# EAGLE design Falange_Lite (EAGLE 7.6.0)
CNAME: OffGrid-Devices Falange; CREVISION: B; DESIGNER: Tiago Angelo
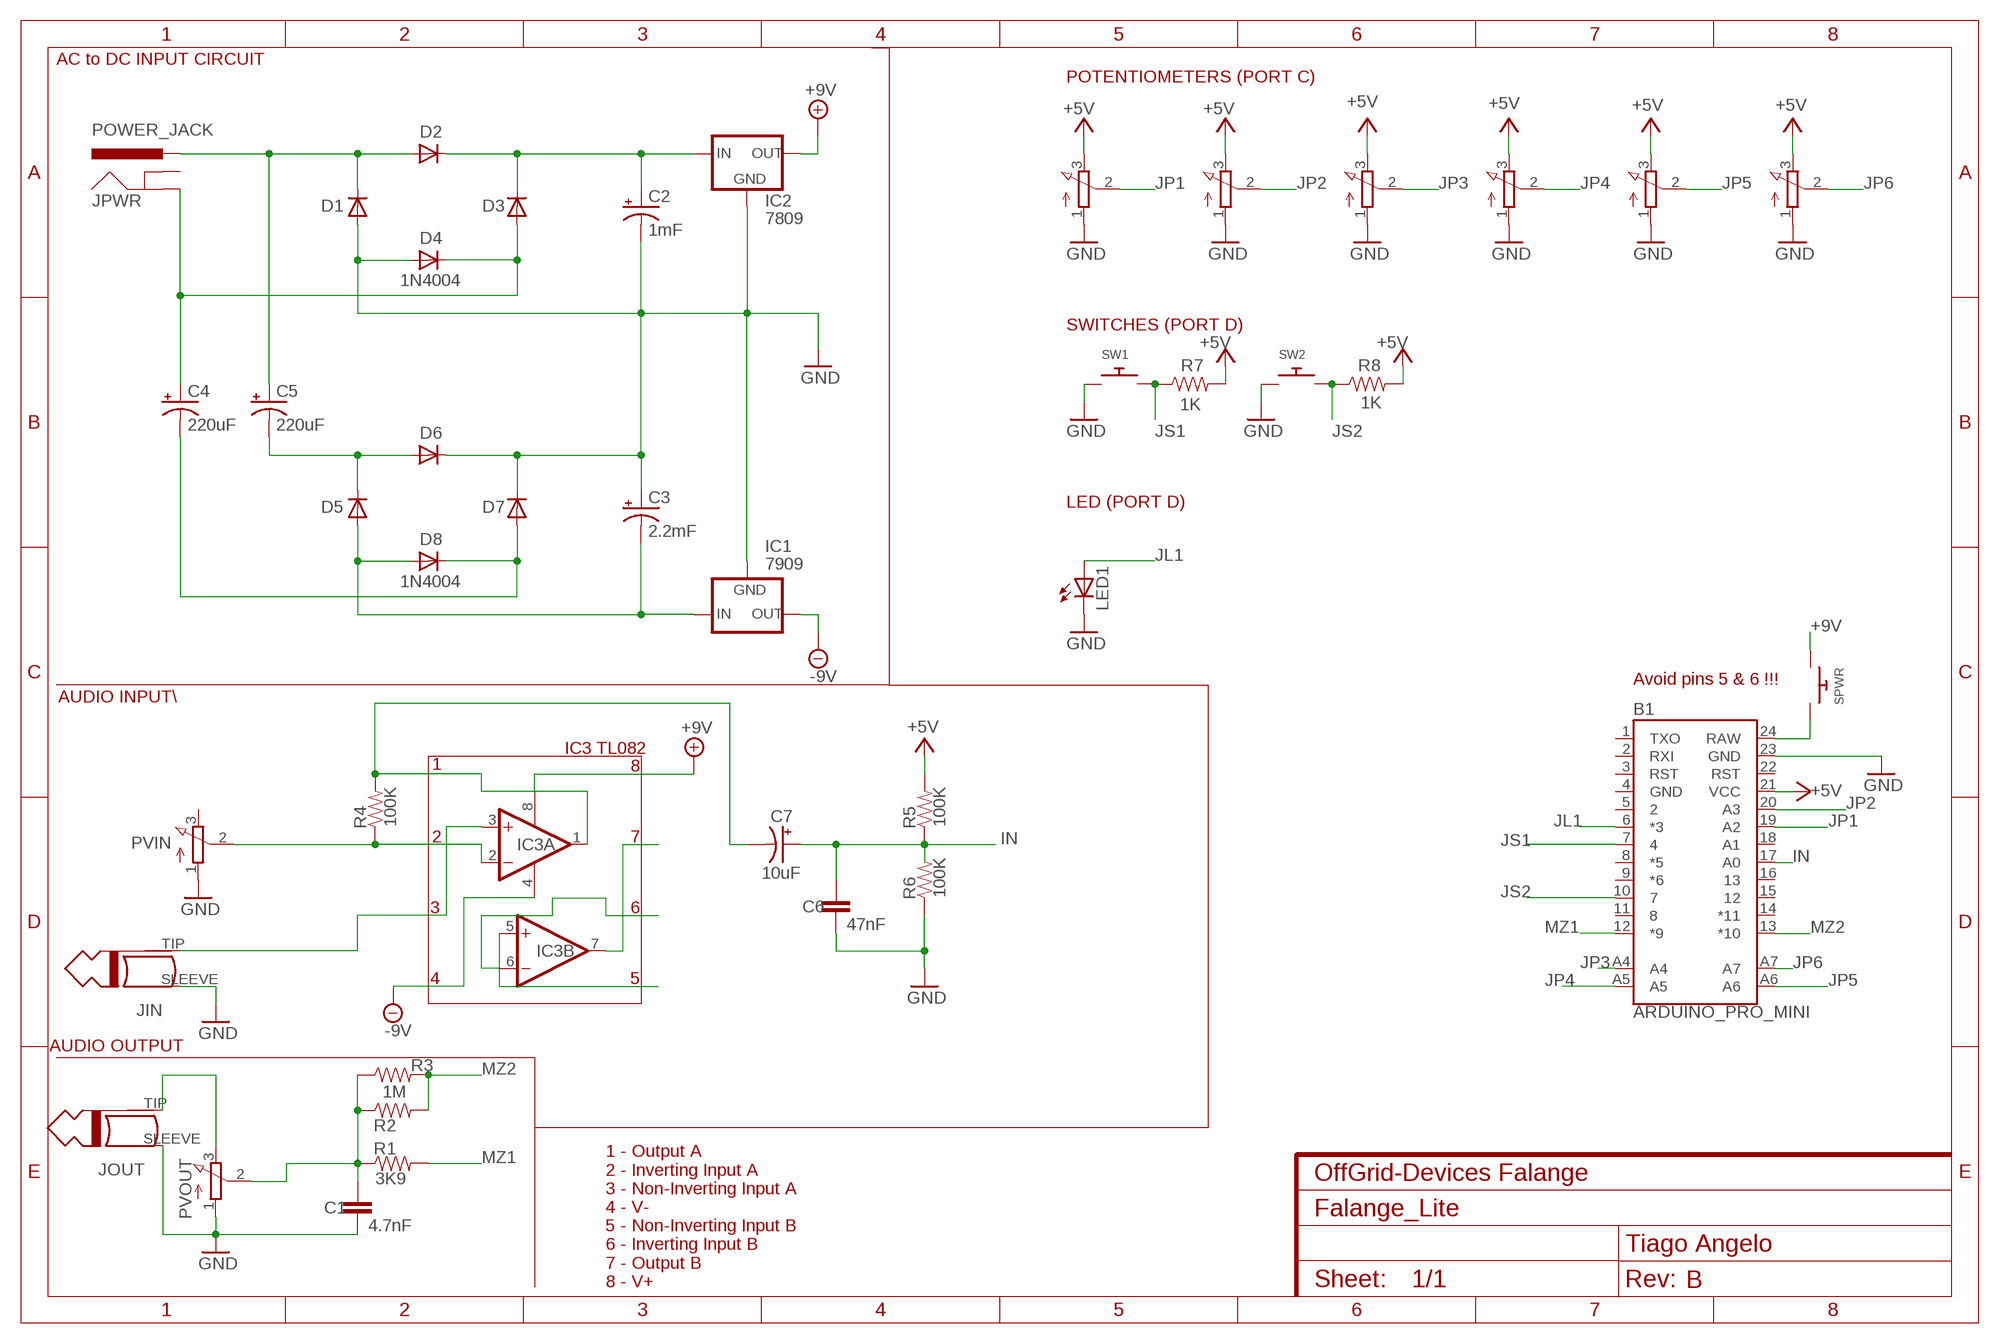
[diagram p0: schematic, sheet 1]

## Parts
B1  ARDUINO_PRO_MINI  [ARDUINO_PRO_MINI]
C1  4.7nF  C-EU050-025X075  [C050-025X075]
C2  1mF  CPOL-USE30-16AXIAL  [E30-16]
C3  2.2mF  CPOL-USE35-16AXIAL  [E35-16]
C4  220uF  CPOL-USE5-10.5  [E5-10,5]
C5  220uF  CPOL-USE5-10.5  [E5-10,5]
C6  47nF  C-EU050-025X075  [C050-025X075]
C7  10uF  CPOL-USE2.5-6  [E2,5-6]
D1  1N4004  [DO41-10]
D2  1N4004  [DO41-10]
D3  1N4004  [DO41-10]
D4  1N4004  [DO41-10]
D5  1N4004  [DO41-10]
D6  1N4004  [DO41-10]
D7  1N4004  [DO41-10]
D8  1N4004  [DO41-10]
IC1  7909  79XXL  [79XXL]
IC2  7809  78XXL  [78XXL]
IC3  TL082P  [DIL08]
JIN  MONO_PLUG  [TWO_PADS]
JOUT  MONO_PLUG  [TWO_PADS]
JPWR  POWER_JACK  [POWER_JACK_PTH]
LED1  LED3MM  [LED3MM]
P1  3RP/1610N  [3RP/1610N]
P2  3RP/1610N  [3RP/1610N]
P3  3RP/1610N  [3RP/1610N]
P4  3RP/1610N  [3RP/1610N]
P5  3RP/1610N  [3RP/1610N]
P6  3RP/1610N  [3RP/1610N]
PVIN  3RP/1610N  [3RP/1610N]
PVOUT  3RP/1610N  [3RP/1610N]
R1  3K9  1KOHM-HORIZ-1/4W-5%  [AXIAL-0.3]
R2  1M  1KOHM-HORIZ-1/4W-5%  [AXIAL-0.3]
R3  1M  1KOHM-HORIZ-1/4W-5%  [AXIAL-0.3]
R4  100K  1KOHM-HORIZ-1/4W-5%  [AXIAL-0.3]
R5  100K  1KOHM-HORIZ-1/4W-5%  [AXIAL-0.3]
R6  100K  1KOHM-HORIZ-1/4W-5%  [AXIAL-0.3]
R7  1K  1KOHM-HORIZ-1/4W-5%  [AXIAL-0.3]
R8  1K  1KOHM-HORIZ-1/4W-5%  [AXIAL-0.3]
SPWR  SWITCH_PUSHBUTTONEVQ-PE  [TACT_PANA-EVQ]
SW1  SWITCH_PUSHBUTTONEVQ-PE  [TACT_PANA-EVQ]
SW2  SWITCH_PUSHBUTTONEVQ-PE  [TACT_PANA-EVQ]

## Nets
+5V: B1.21(VCC) P1.3(E) P2.3(E) P3.3(E) P4.3(E) P5.3(E) P6.3(E) R5.P$2 R7.P$2 R8.P$2
+9V: IC2.OUT IC3.8(P:V+) SPWR.P$1
-9V: IC1.OUT IC3.4(P:V-)
GND: B1.23(GND) C1.2 C2.- C3.+ C6.2 D1.A D4.A D6.C D7.C IC1.GND IC2.GND JIN.SLEEVE JOUT.SLEEVE LED1.K(C) P1.1(A) P2.1(A) P3.1(A) P4.1(A) P5.1(A) P6.1(A) PVIN.1(A) PVOUT.1(A) R6.P$1 SW1.P$1 SW2.P$1
IN: B1.17(A0) C6.1 C7.+ R5.P$1 R6.P$2
JL1: B1.6(*3) LED1.A
JP1: B1.19(A2) P1.2(S)
JP2: B1.20(A3) P2.2(S)
JP3: B1.A4 P3.2(S)
JP4: B1.A5 P4.2(S)
JP5: B1.A6 P5.2(S)
JP6: B1.A7 P6.2(S)
JP8-2: C1.1 PVOUT.2(S) R1.P$1 R2.P$1 R3.P$1
JP8-3: JOUT.TIP PVOUT.3(E)
JS1: B1.7 R7.P$1 SW1.P$2
JS2: B1.10 R8.P$1 SW2.P$2
MZ1: B1.12(*9) R1.P$2
MZ2: B1.13(*10) R2.P$2 R3.P$2
N$1: C5.+ D1.C D2.A JPWR.PWR
N$2: C5.- D5.C D6.A
N$3: C4.+ D3.A D4.C JPWR.GND
N$4: C4.- D7.A D8.C
N$5: C2.+ D2.C D3.C IC2.IN
N$6: B1.24(RAW) SPWR.P$2
N$7: C3.- D5.A D8.A IC1.IN
N$8: C7.- IC3.1(A:OUT) R4.P$2
N$9: IC3.2(A:-IN) PVIN.2(S) R4.P$1
N$12: IC3.7(B:OUT)
N$13: IC3.6(B:-IN)
N$14: IC3.5(B:+IN)
N$15: IC3.3(A:+IN) JIN.TIP
Unconnected: B1.1(TXO) B1.2(RXI) B1.3(RST) B1.5 B1.8(*5) B1.9(*6) B1.11 B1.14(*11) B1.15 B1.16 B1.18(A1) B1.22(RST) JPWR.GNDBREAK PVIN.3(E)

## Notes on the sheet
- AC to DC INPUT CIRCUIT
- POTENTIOMETERS (PORT C)
- SWITCHES (PORT D)
- LED (PORT D)
- Avoid pins 5 & 6 !!!
- AUDIO INPUT\
- IC3 TL082
- 1 | 8
- 2 | 7
- 3 | 6
- 4 | 5
- AUDIO OUTPUT
- 1 - Output A
  2 - Inverting Input A
  3 - Non-Inverting Input A
  4 - V-
  5 - Non-Inverting Input B
  6 - Inverting Input B
  7 - Output B
  8 - V+

## Power pins joined to a net without a drawn wire
GND: B1.4(GND)

## Library data of the parts
B1 = SparkFun-Boards:ARDUINO_PRO_MINI: SparkFun Pro Mini Pro Mini compatible footprint. Dimensions: 0.7 x 1.3" PCB Thickness: 0.8mm SparkFun Products: 3.3V/8MHz <https://www.sparkfun.com/products/11114> 5V/16MHz <https://www.sparkfun.com/products/11113>
C1 C6 = rcl:C-EU: CAPACITOR, European symbol
C2 C3 = offgrid-devices:CPOL-US: POLARIZED CAPACITOR, American symbol
C4 C5 C7 = rcl:CPOL-US: POLARIZED CAPACITOR, American symbol
D1-D8 = adafruit:1N4004: DIODE General purpose 1N400x type rectifier (With bigger pads) http://www.ladyada.net/library/pcb/eaglelibrary.html
IC1 = v-reg:79XXL: VOLTAGE REGULATOR
IC2 = v-reg:78XXL: VOLTAGE REGULATOR
IC3 = linear:TL082: OP AMP Data sheet <http://www.ti.com/lit/ds/symlink/tl084a . pdf>; DATA_SHEET: <a href="http://www.ti.com/lit/ds/symlink/tl084a.pdf"> Data sheet </a>
JIN JOUT = gm-jacks:MONO_PLUG
JPWR = SparkFun-Connectors:POWER_JACK: Power Jack Connector This is the standard 5.5mm barrel jack for power. The PTH is the most common, proven, reliable, footprint. The Slot footprint only works if the mill layer is transmitted to the PCB fab house so be warned. Here are the connectors we sell at SparkFun: DC Barrel Power Jack/Connector <https://www.sparkfun.com/products/119> (PRT-00119) DC Barrel Power Jack/Connector (SMD) <https://www.sparkfun.com/products/12748> (PRT-12748) DC Barrel Jack Adapter - Breadboard Compatible <https://www.sparkfun.com/products/10811> (PRT-10811) It is used on this SparkFun product (and many, many others): SparkFun RedBoard - Programmed with Arduino <https://www.sparkfun.com/products/12757> (DEV-12757) Also, if you need a mating power supply or connector, please check these out: Wall Adapter Power Supply - 9VDC 650mA <https://www.sparkfun.com/products/298> (TOL-00298) DC Barrel Jack Adapter - Male <https://www.sparkfun.com/products/10287> (PRT-10287); PROD_ID: CONN-08197
LED1 = led:LED: LED OSRAM: - CHIPLED LG R971, LG N971, LY N971, LG Q971, LY Q971, LO R971, LY R971 LH N974, LH R974 LS Q976, LO Q976, LY Q976 LO Q996 - Hyper CHIPLED LW Q18S LB Q993, LB Q99A, LB R99A - SideLED LS A670, LO A670, LY A670, LG A670, LP A670 LB A673, LV A673, LT A673, LW A673 LH A674 LY A675 LS A676, LA A676, LO A676, LY A676, LW A676 LS A679, LY A679, LG A679 - Hyper Micro SIDELED® LS Y876, LA Y876, LO Y876, LY Y876 LT Y87S - SmartLED LW L88C, LW L88S LB L89C, LB L89S, LG L890 LS L89K, LO L89K, LY L89K LS L896, LA L896, LO L896, LY L896 - TOPLED LS T670, LO T670, LY T670, LG T670, LP T670 LSG T670, LSP T670, LSY T670, LOP T670, LYG T670 LG T671, LOG T671, LSG T671 LB T673, LV T673, LT T673, LW T673 LH T674 LS T676, LA T676, LO T676, LY T676, LB T676, LH T676, LSB T676, LW T676 LB T67C, LV T67C, LT T67C, LS T67K, LO T67K, LY T67K, LW E67C LS E67B, LA E67B, LO E67B, LY E67B, LB E67C, LV E67C, LT E67C LW T67C LS T679, LY T679, LG T679 LS T770, LO T770, LY T770, LG T770, LP T770 LB T773, LV T773, LT T773, LW T773 LH T774 LS E675, LA E675, LY E675, LS T675 LS T776, LA T776, LO T776, LY T776, LB T776 LHGB T686 LT T68C, LB T68C - Hyper Mini TOPLED® LB M676 - Mini TOPLED Santana® LG M470 LS M47K, LO M47K, LY M47K Source: http://www.osram.convergy.de LUXEON: - LUMILED® LXK2-PW12-R00, LXK2-PW12-S00, LXK2-PW14-U00, LXK2-PW14-V00 LXK2-PM12-R00, LXK2-PM12-S00, LXK2-PM14-U00 LXK2-PE12-Q00, LXK2-PE12-R00, LXK2-PE12-S00, LXK2-PE14-T00, LXK2-PE14-U00 LXK2-PB12-K00, LXK2-PB12-L00, LXK2-PB12-M00, LXK2-PB14-N00, LXK2-PB14-P00, LXK2-PB14-Q00 LXK2-PR12-L00, LXK2-PR12-M00, LXK2-PR14-Q00, LXK2-PR14-R00 LXK2-PD12-Q00, LXK2-PD12-R00, LXK2-PD12-S00 LXK2-PH12-R00, LXK2-PH12-S00 LXK2-PL12-P00, LXK2-PL12-Q00, LXK2-PL12-R00 Source: www.luxeon.com KINGBRIGHT: KA-3528ASYC Source: www.kingbright.com
P1-P6 PVIN PVOUT = pot:3RP/1610N: 16mm Potentiometer one level Source: http://www.alphapotentiometers.net/html/16mm_pot_2.html
R1-R8 = SparkFun-Resistors:1KOHM: 1kΩ resistor A resistor is a passive two-terminal electrical component that implements electrical resistance as a circuit element. Resistors act to reduce current flow, and, at the same time, act to lower voltage levels within circuits. - Wikipedia; PROD_ID: RES-08380; VALUE: 1k
SPWR SW1 SW2 = adafruit:SWITCH_PUSHBUTTON: Buttons SOFTTOUCHSMD_SJ - Soft touch temporary push button (Super Junk Akihabara) Compatible with SKPMANE010 [Mouser: 688-SKPMAN] C&K_KSS = Digikey: KSS221GLFS

## Net classes
0 default: width 0.508 mm, drill 0.508 mm, clearance 0.406 mm

## Board
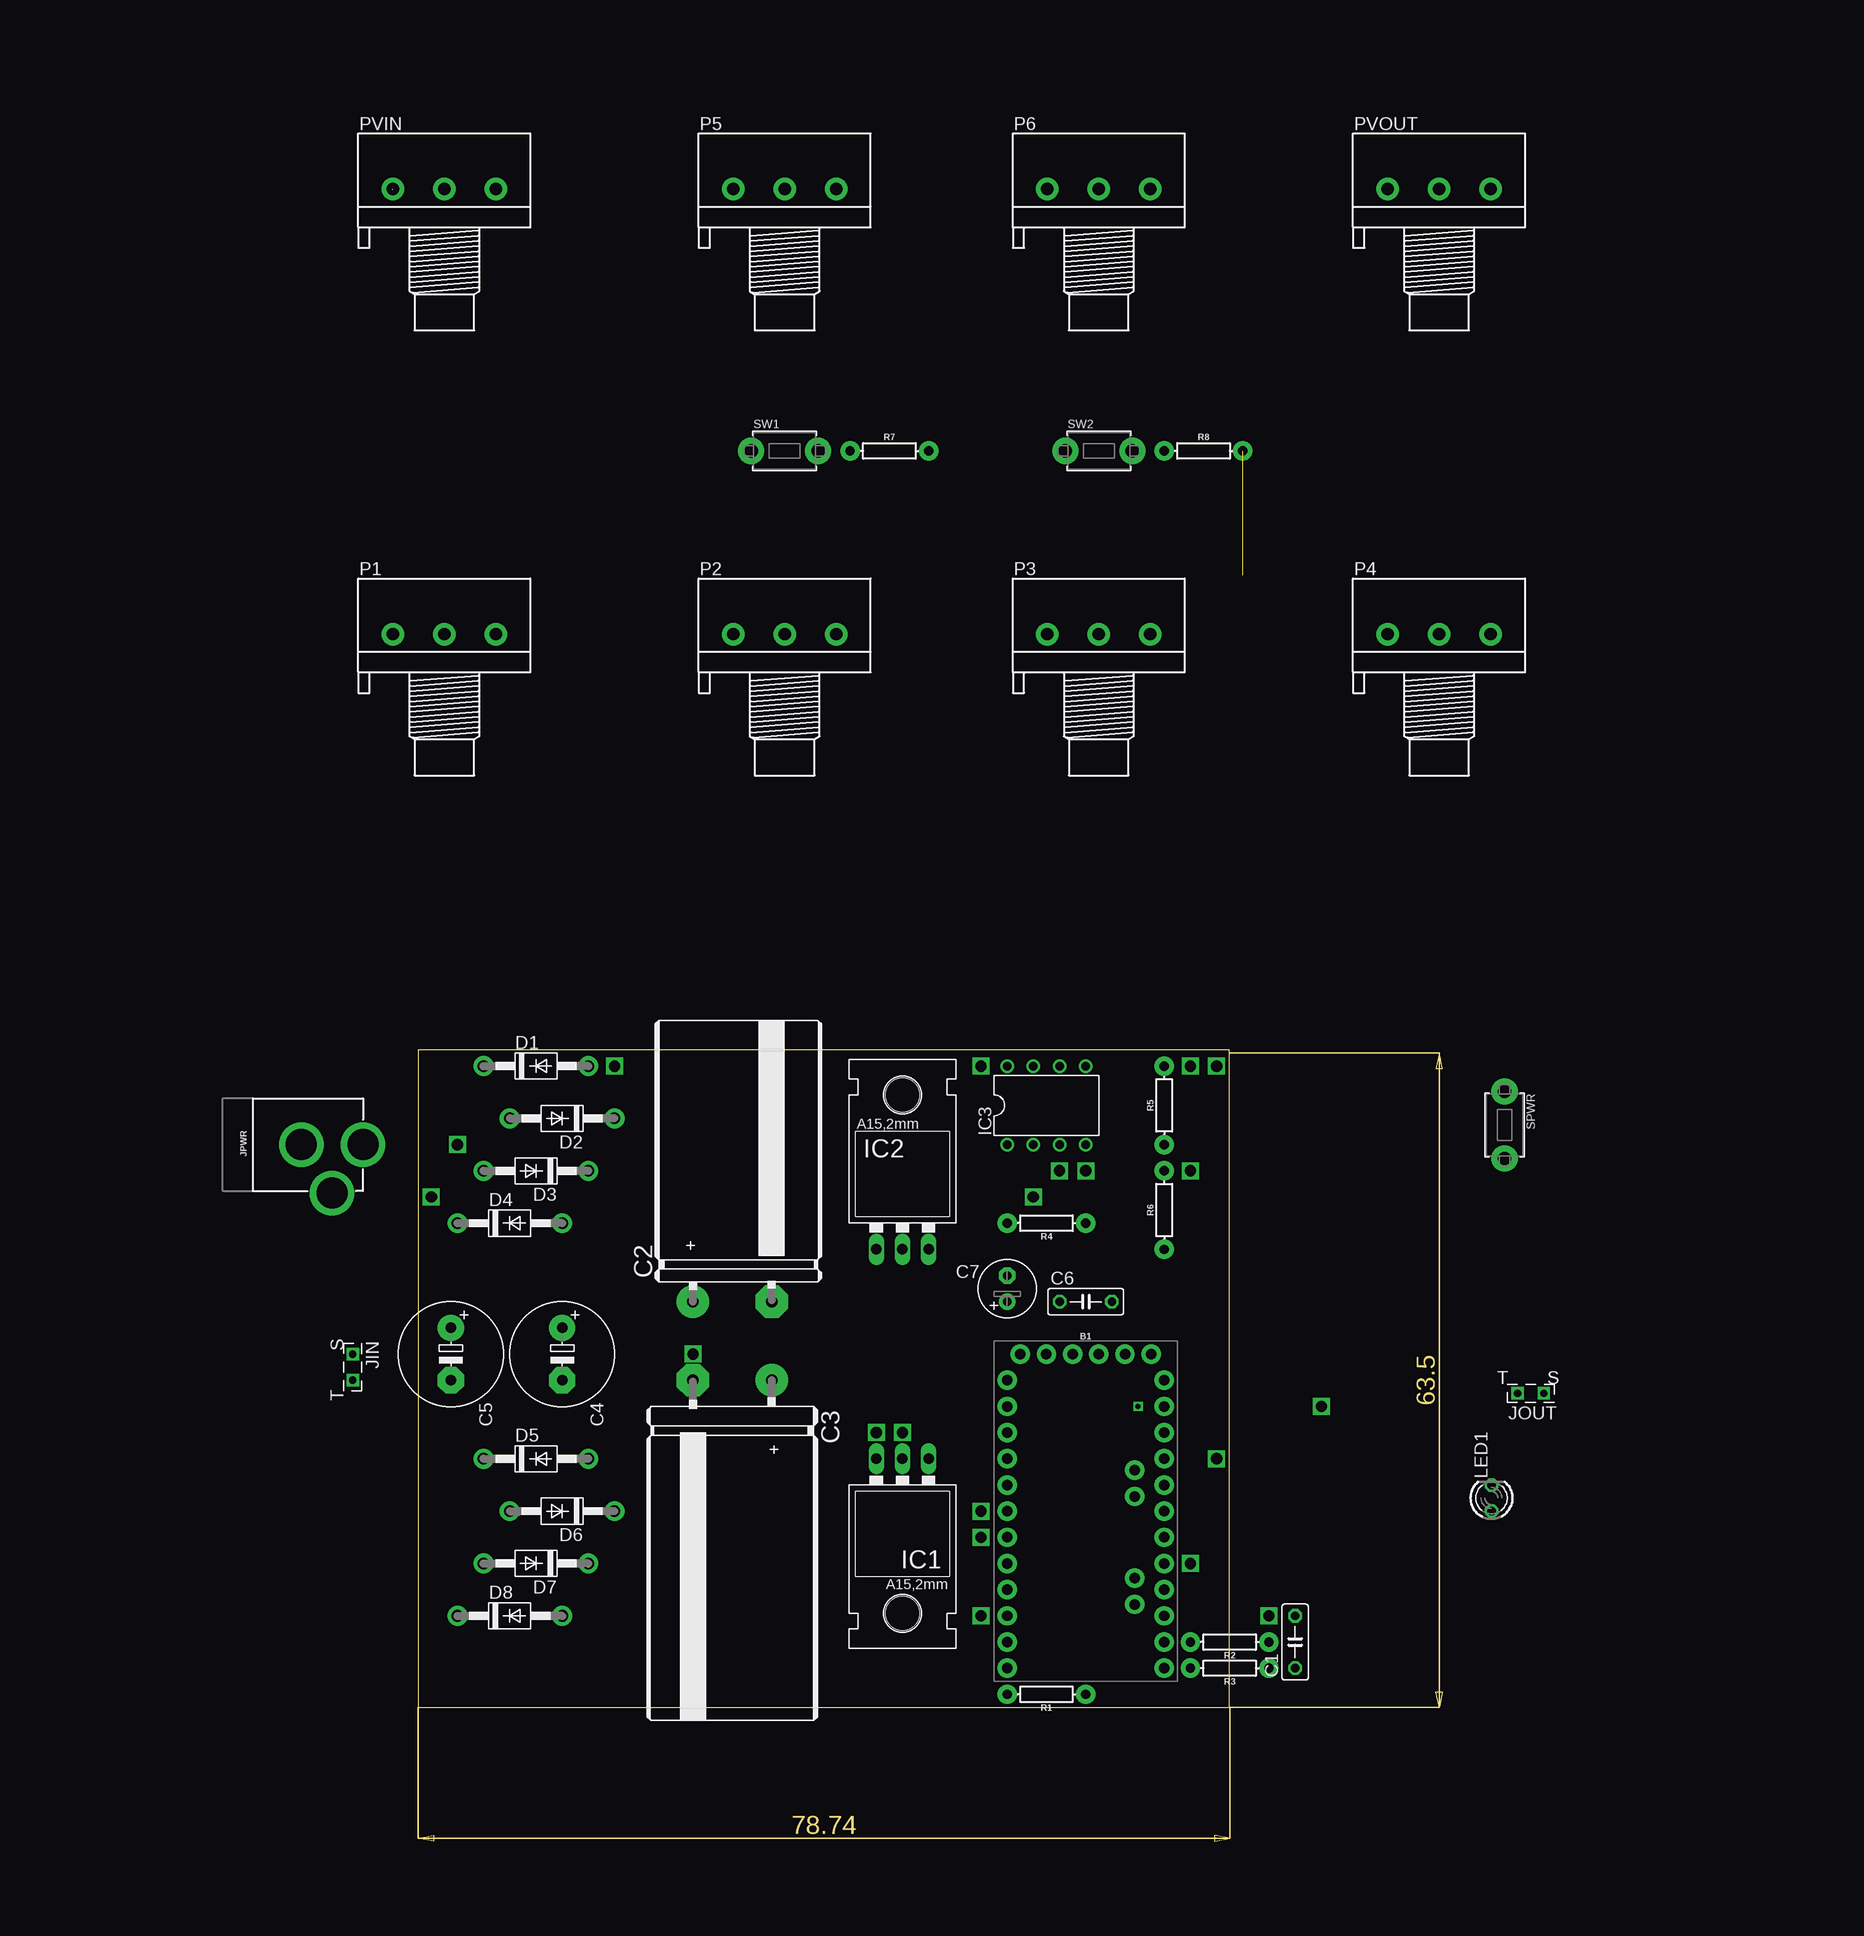
[diagram p1: board, top side]
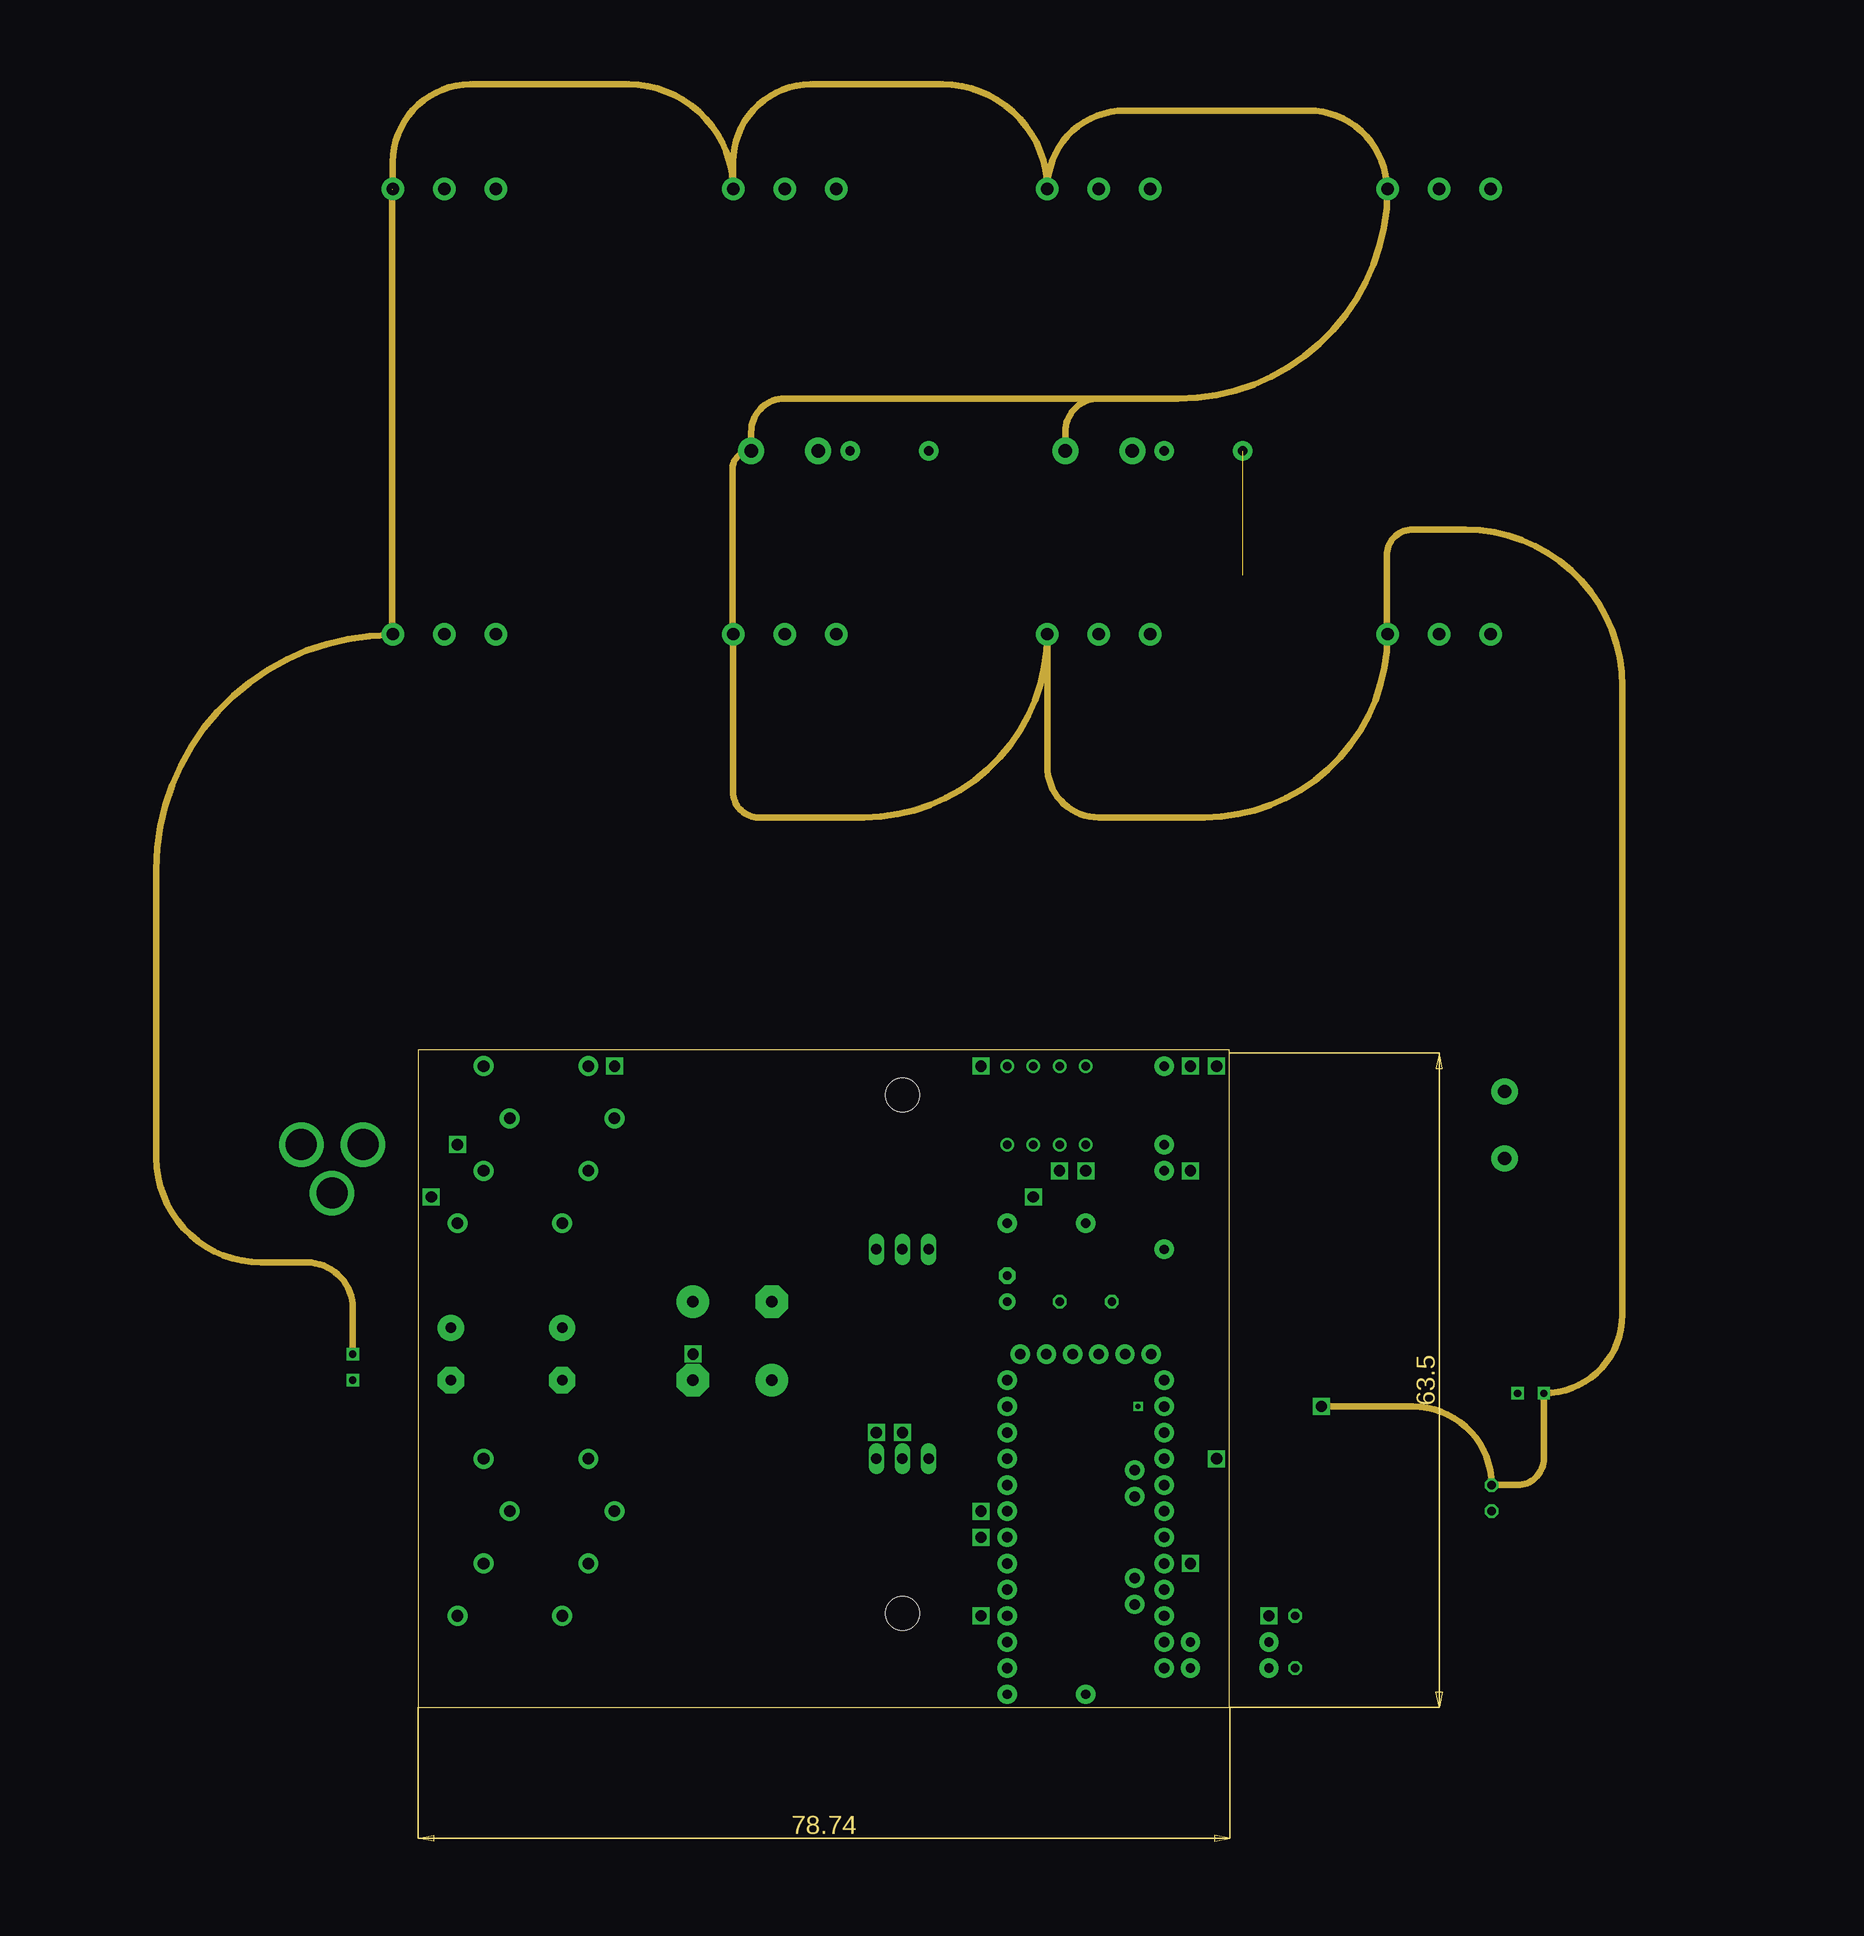
[diagram p2: board, inner layer Ground]
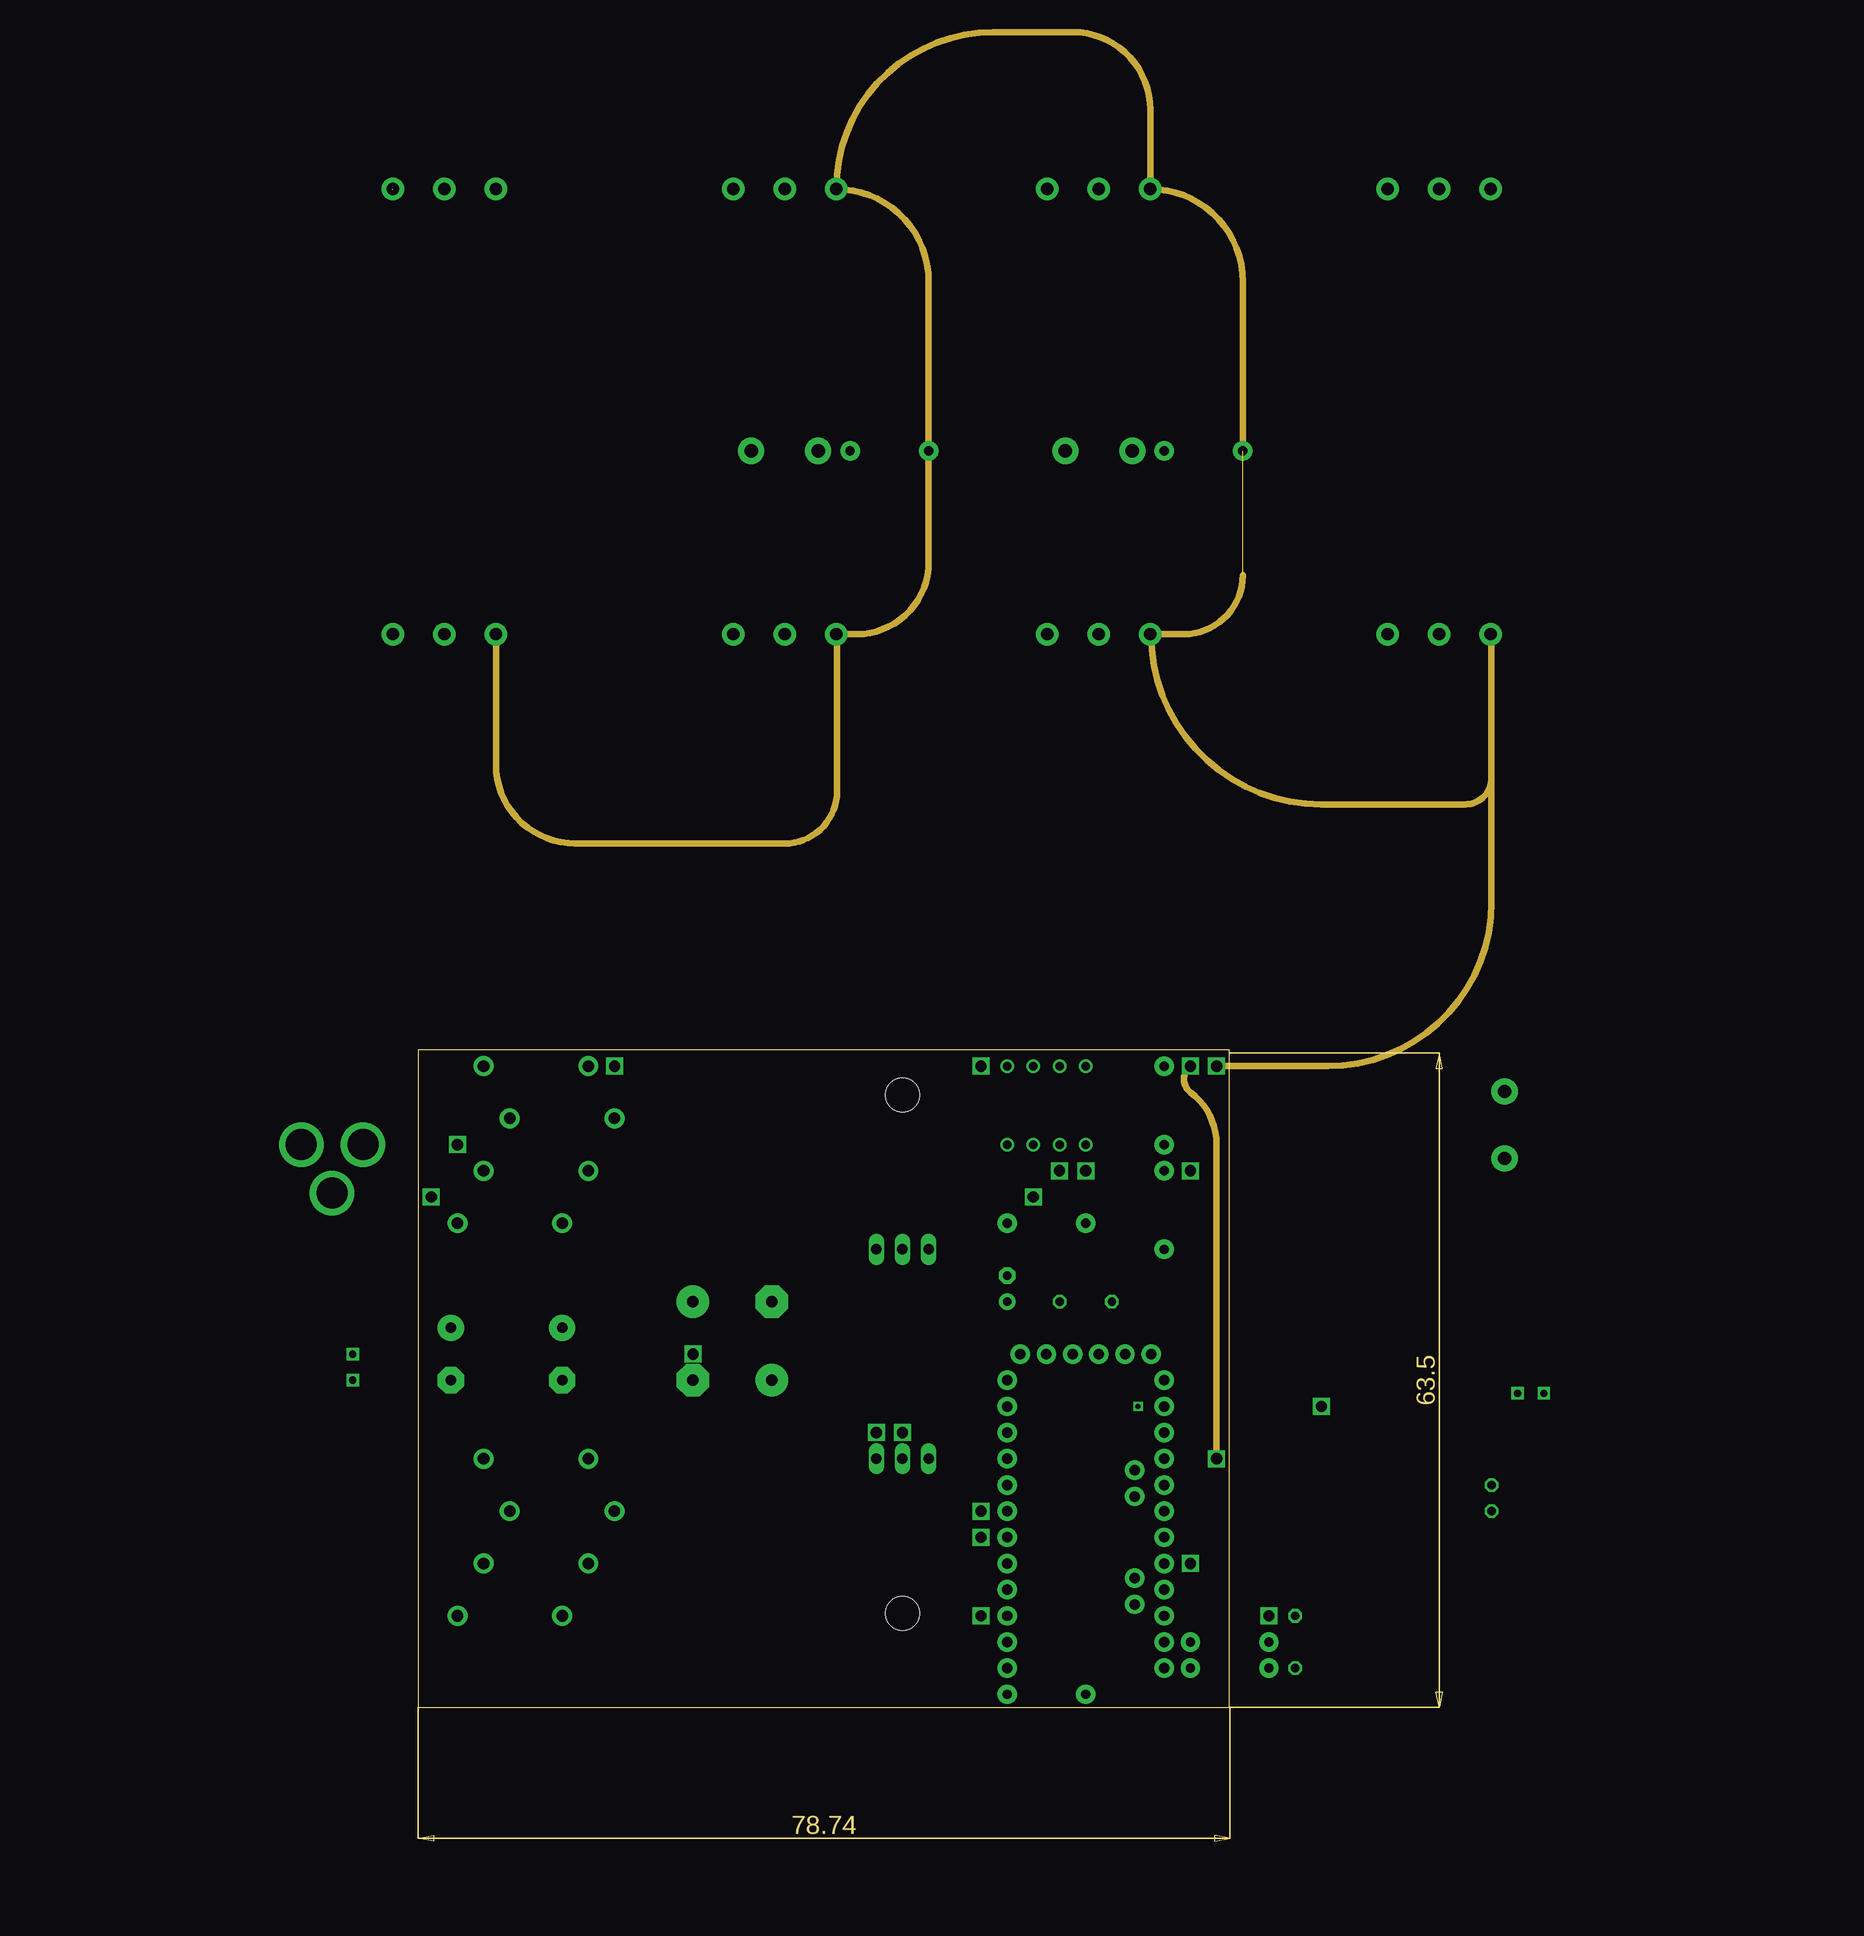
[diagram p3: board, inner layer 5V]
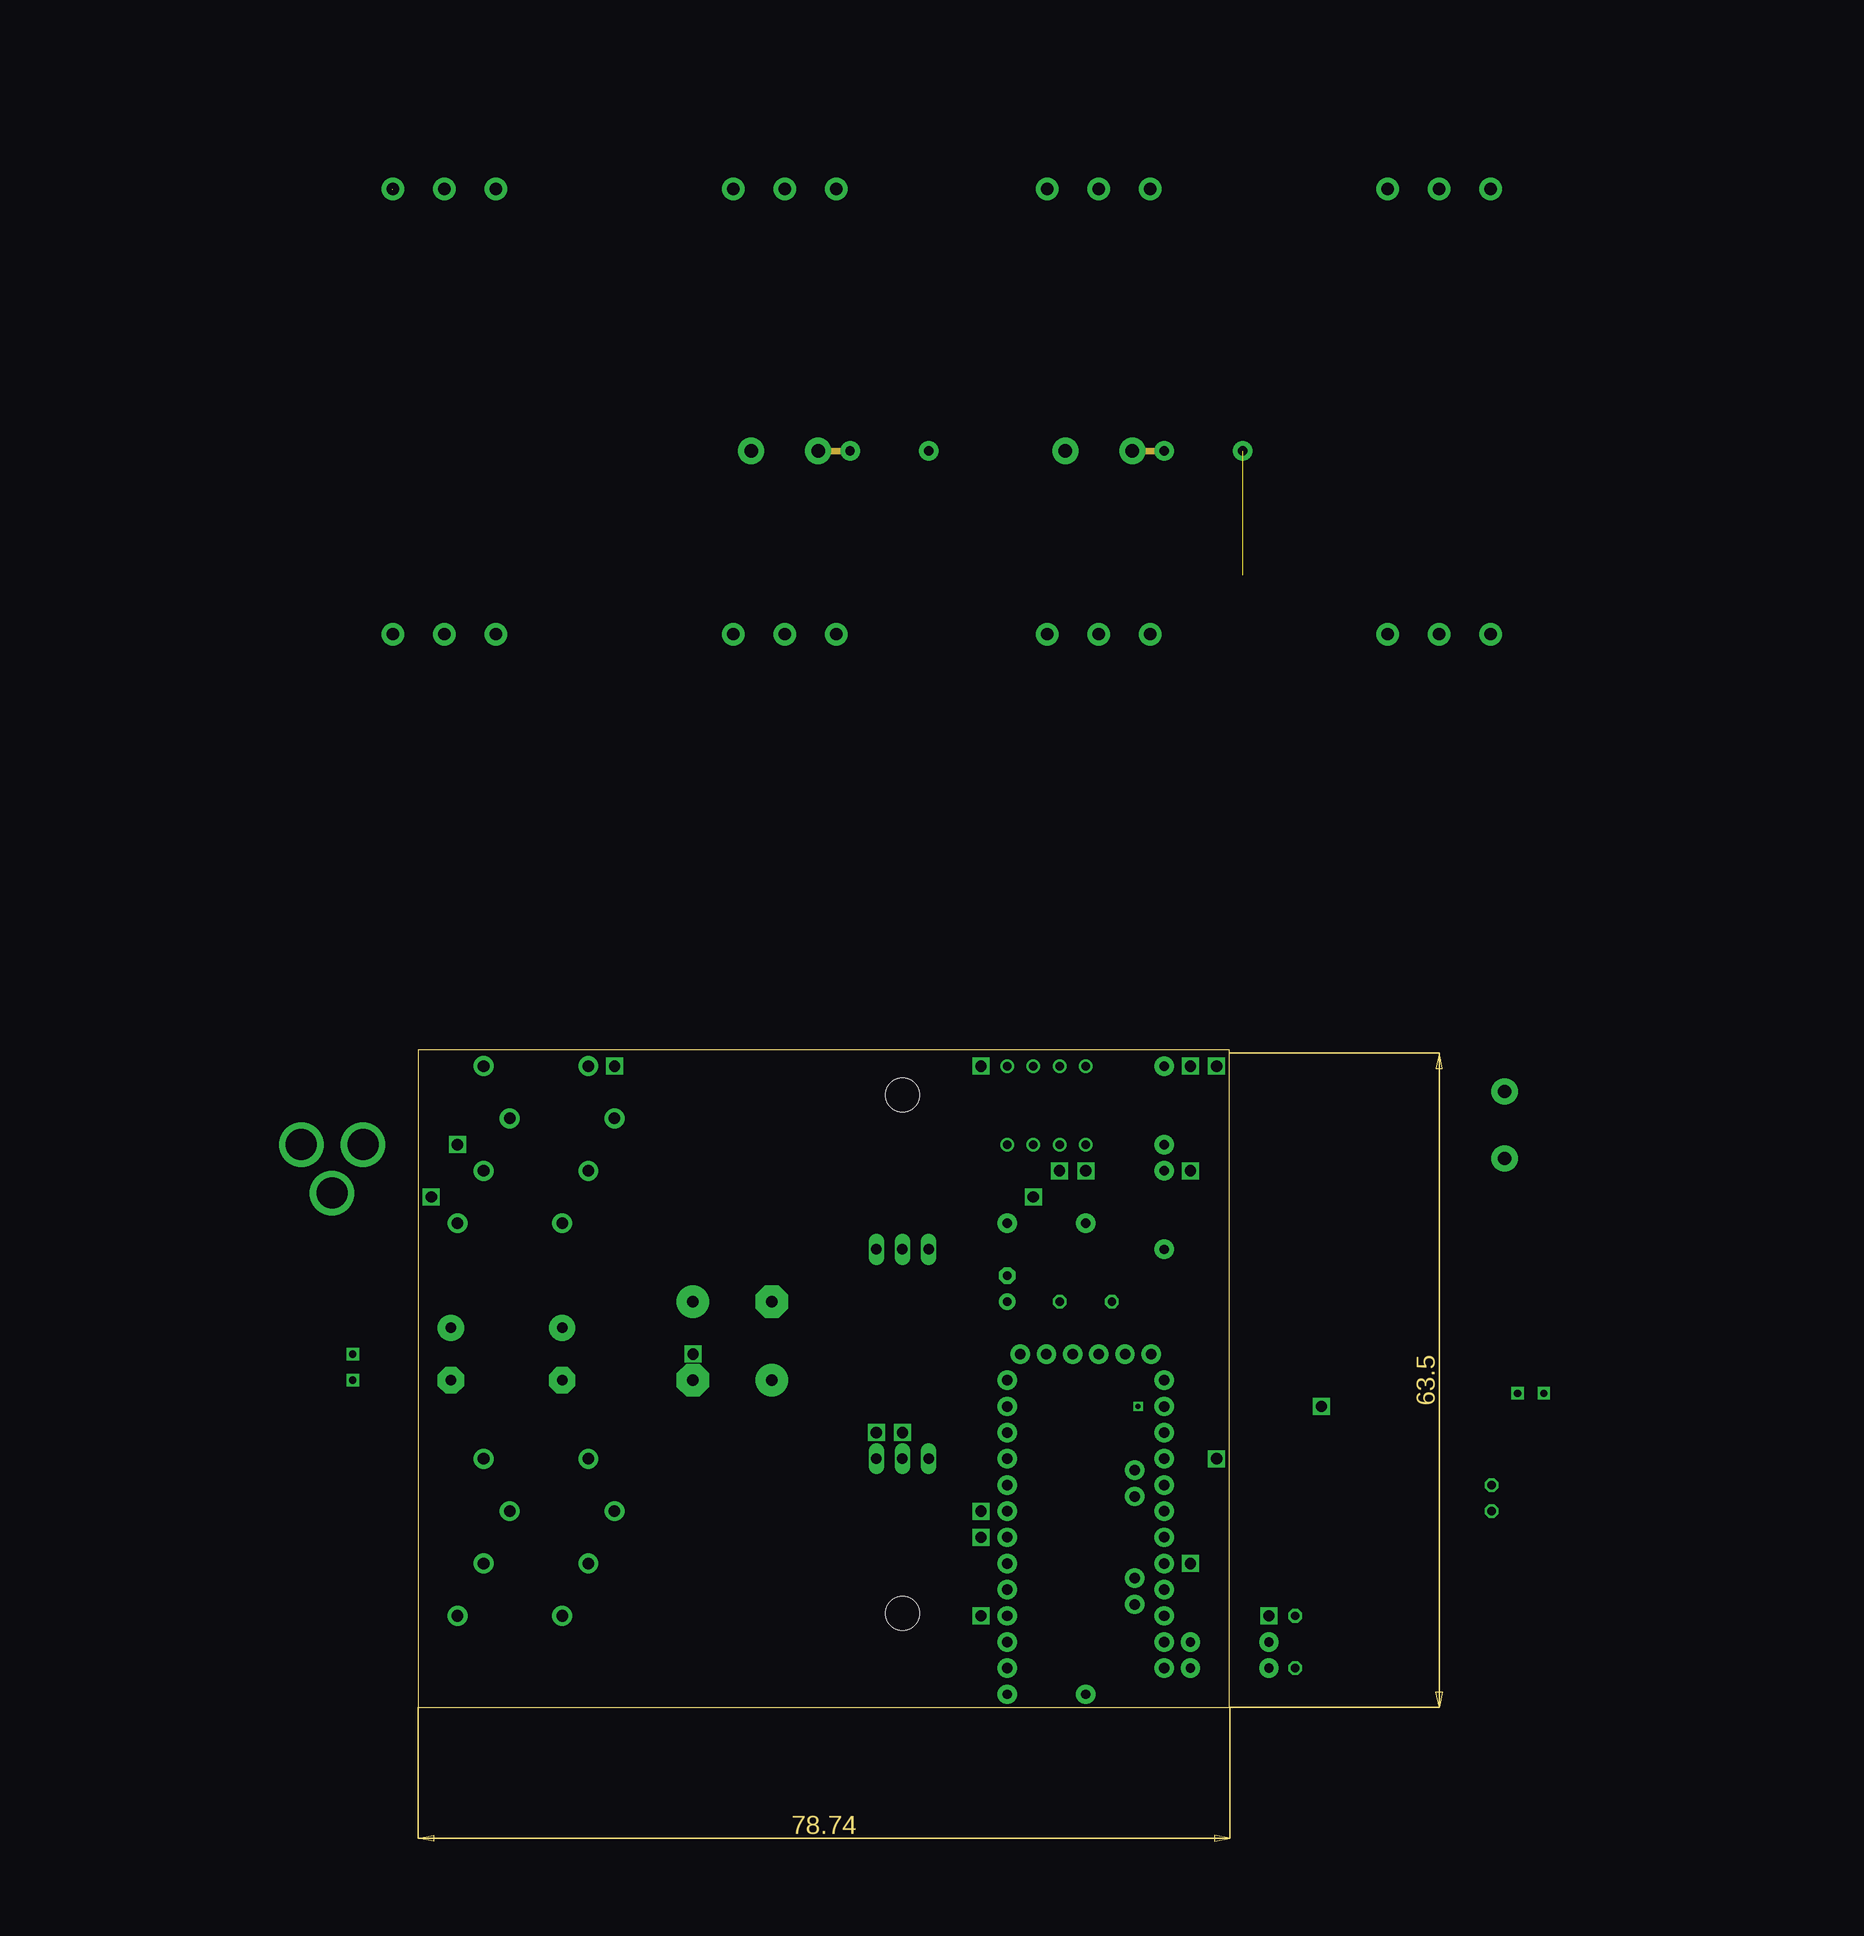
[diagram p4: board, inner layer Component2Component]
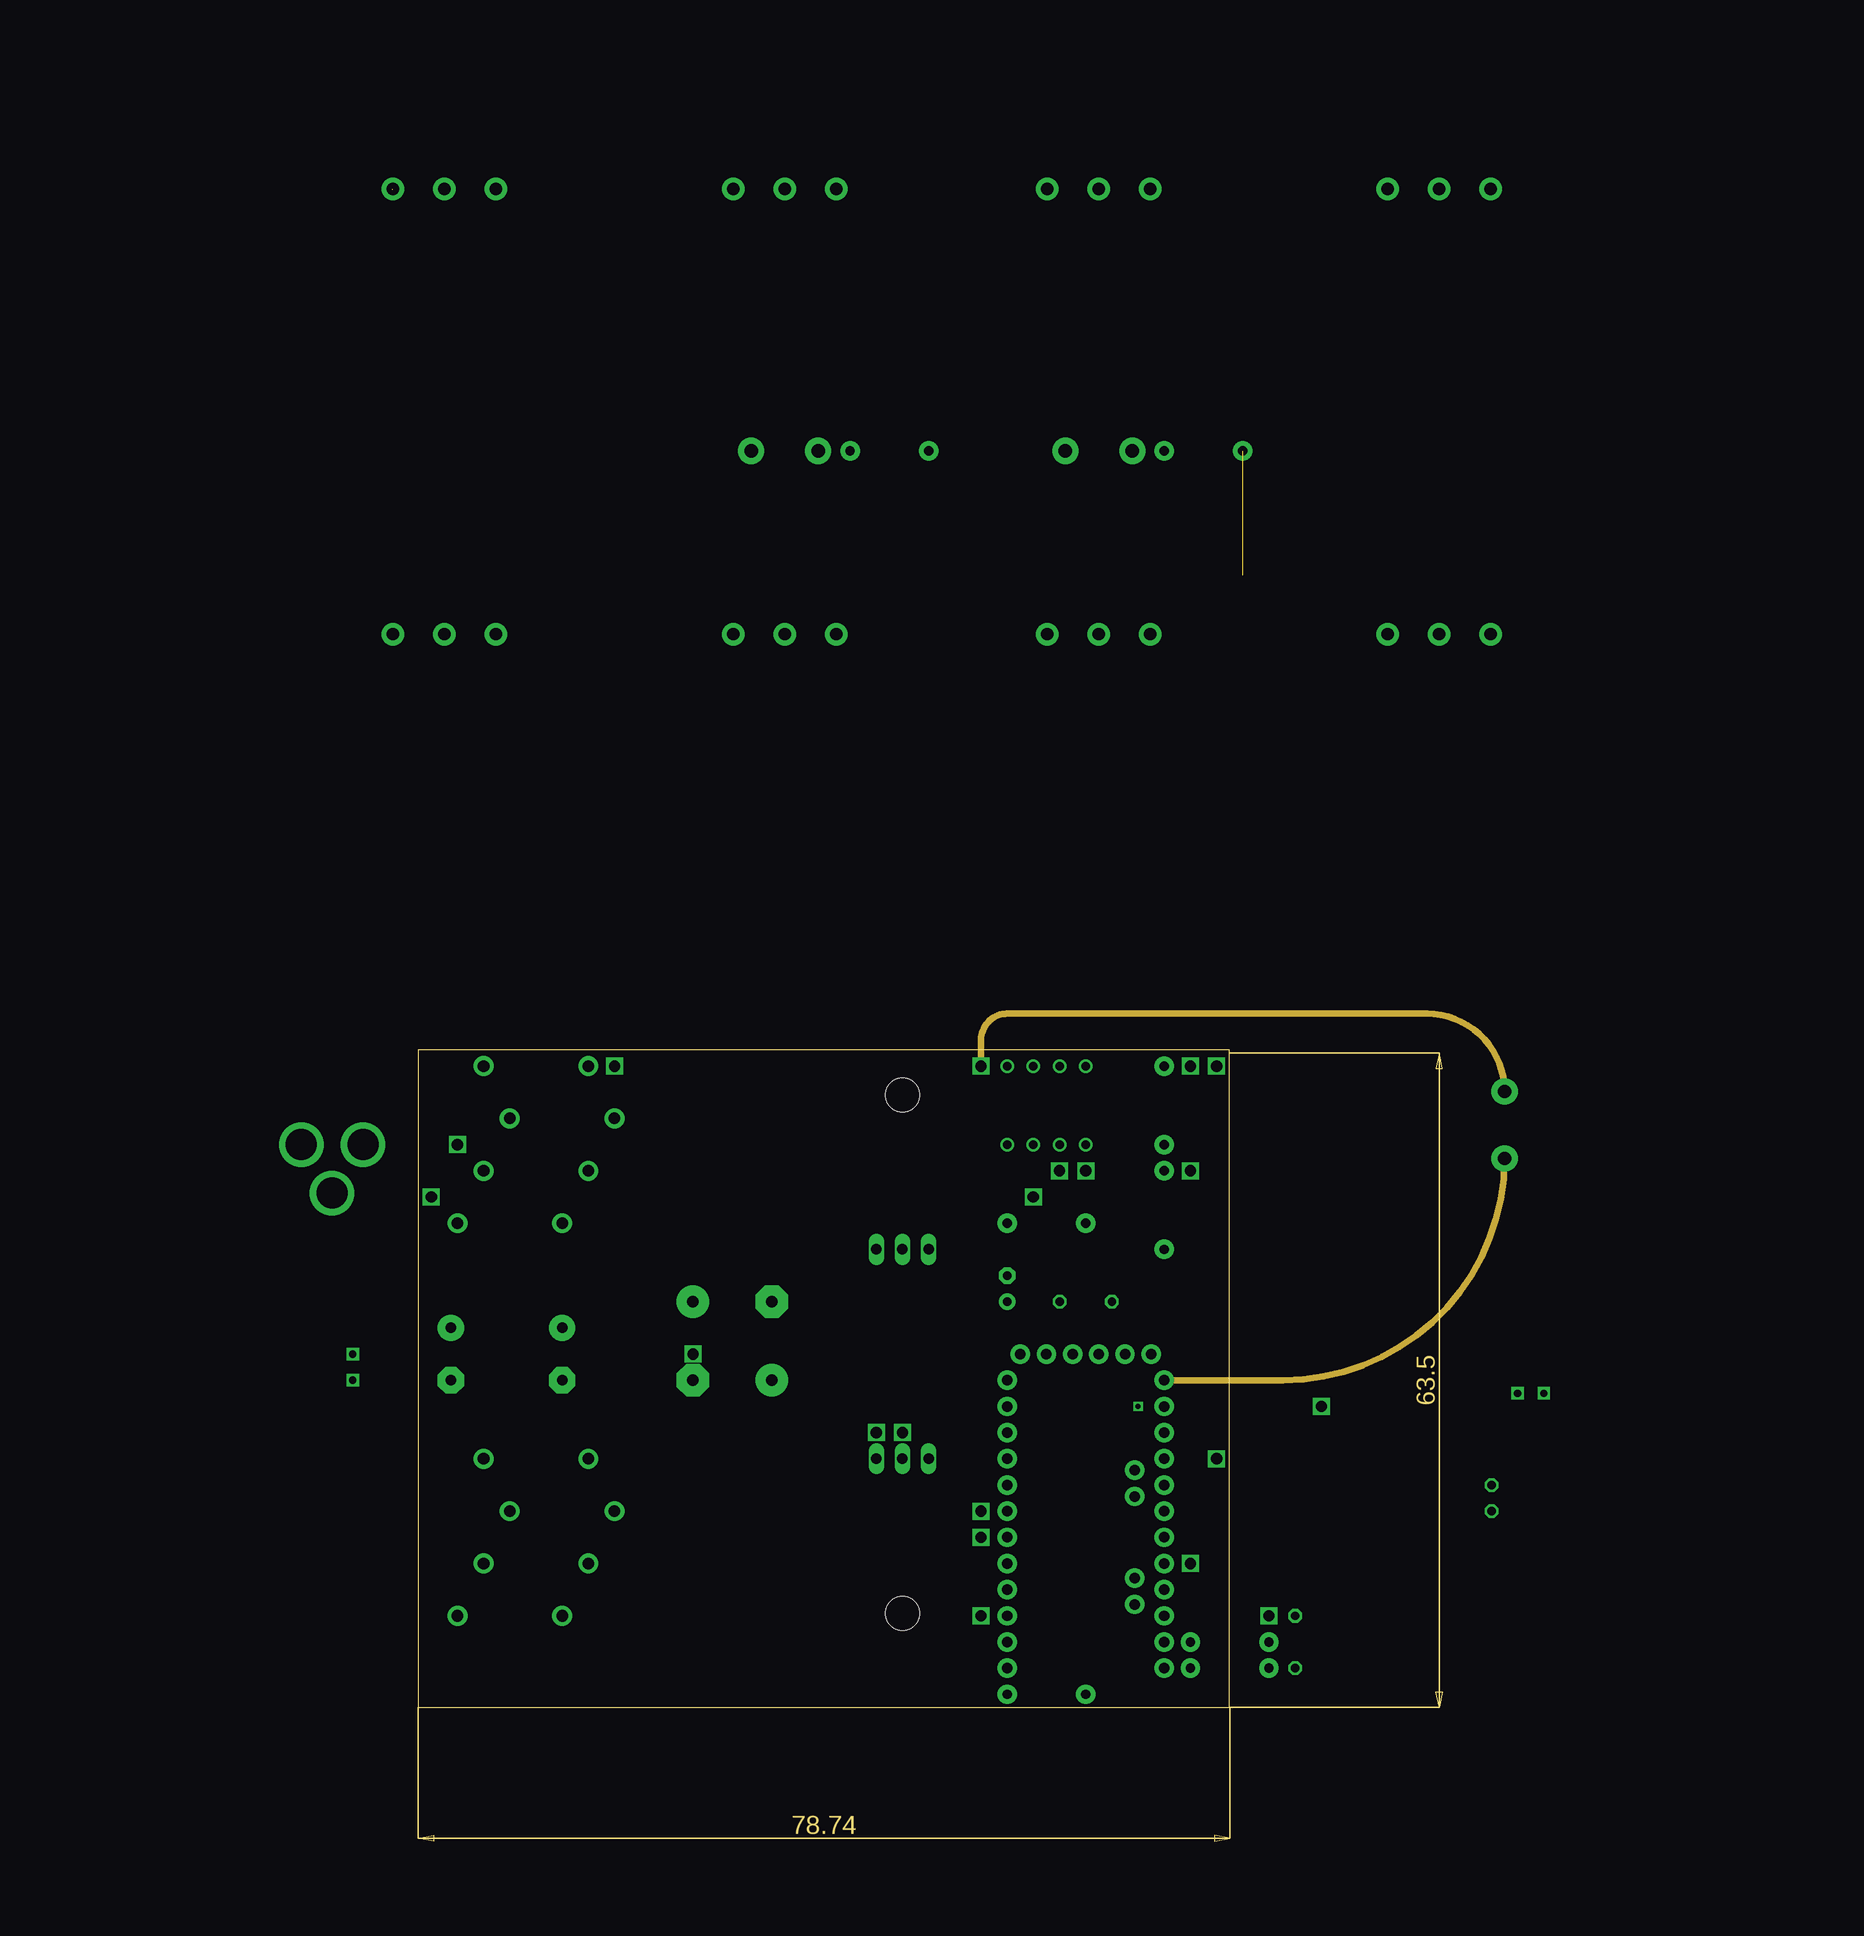
[diagram p5: board, inner layer +9V]
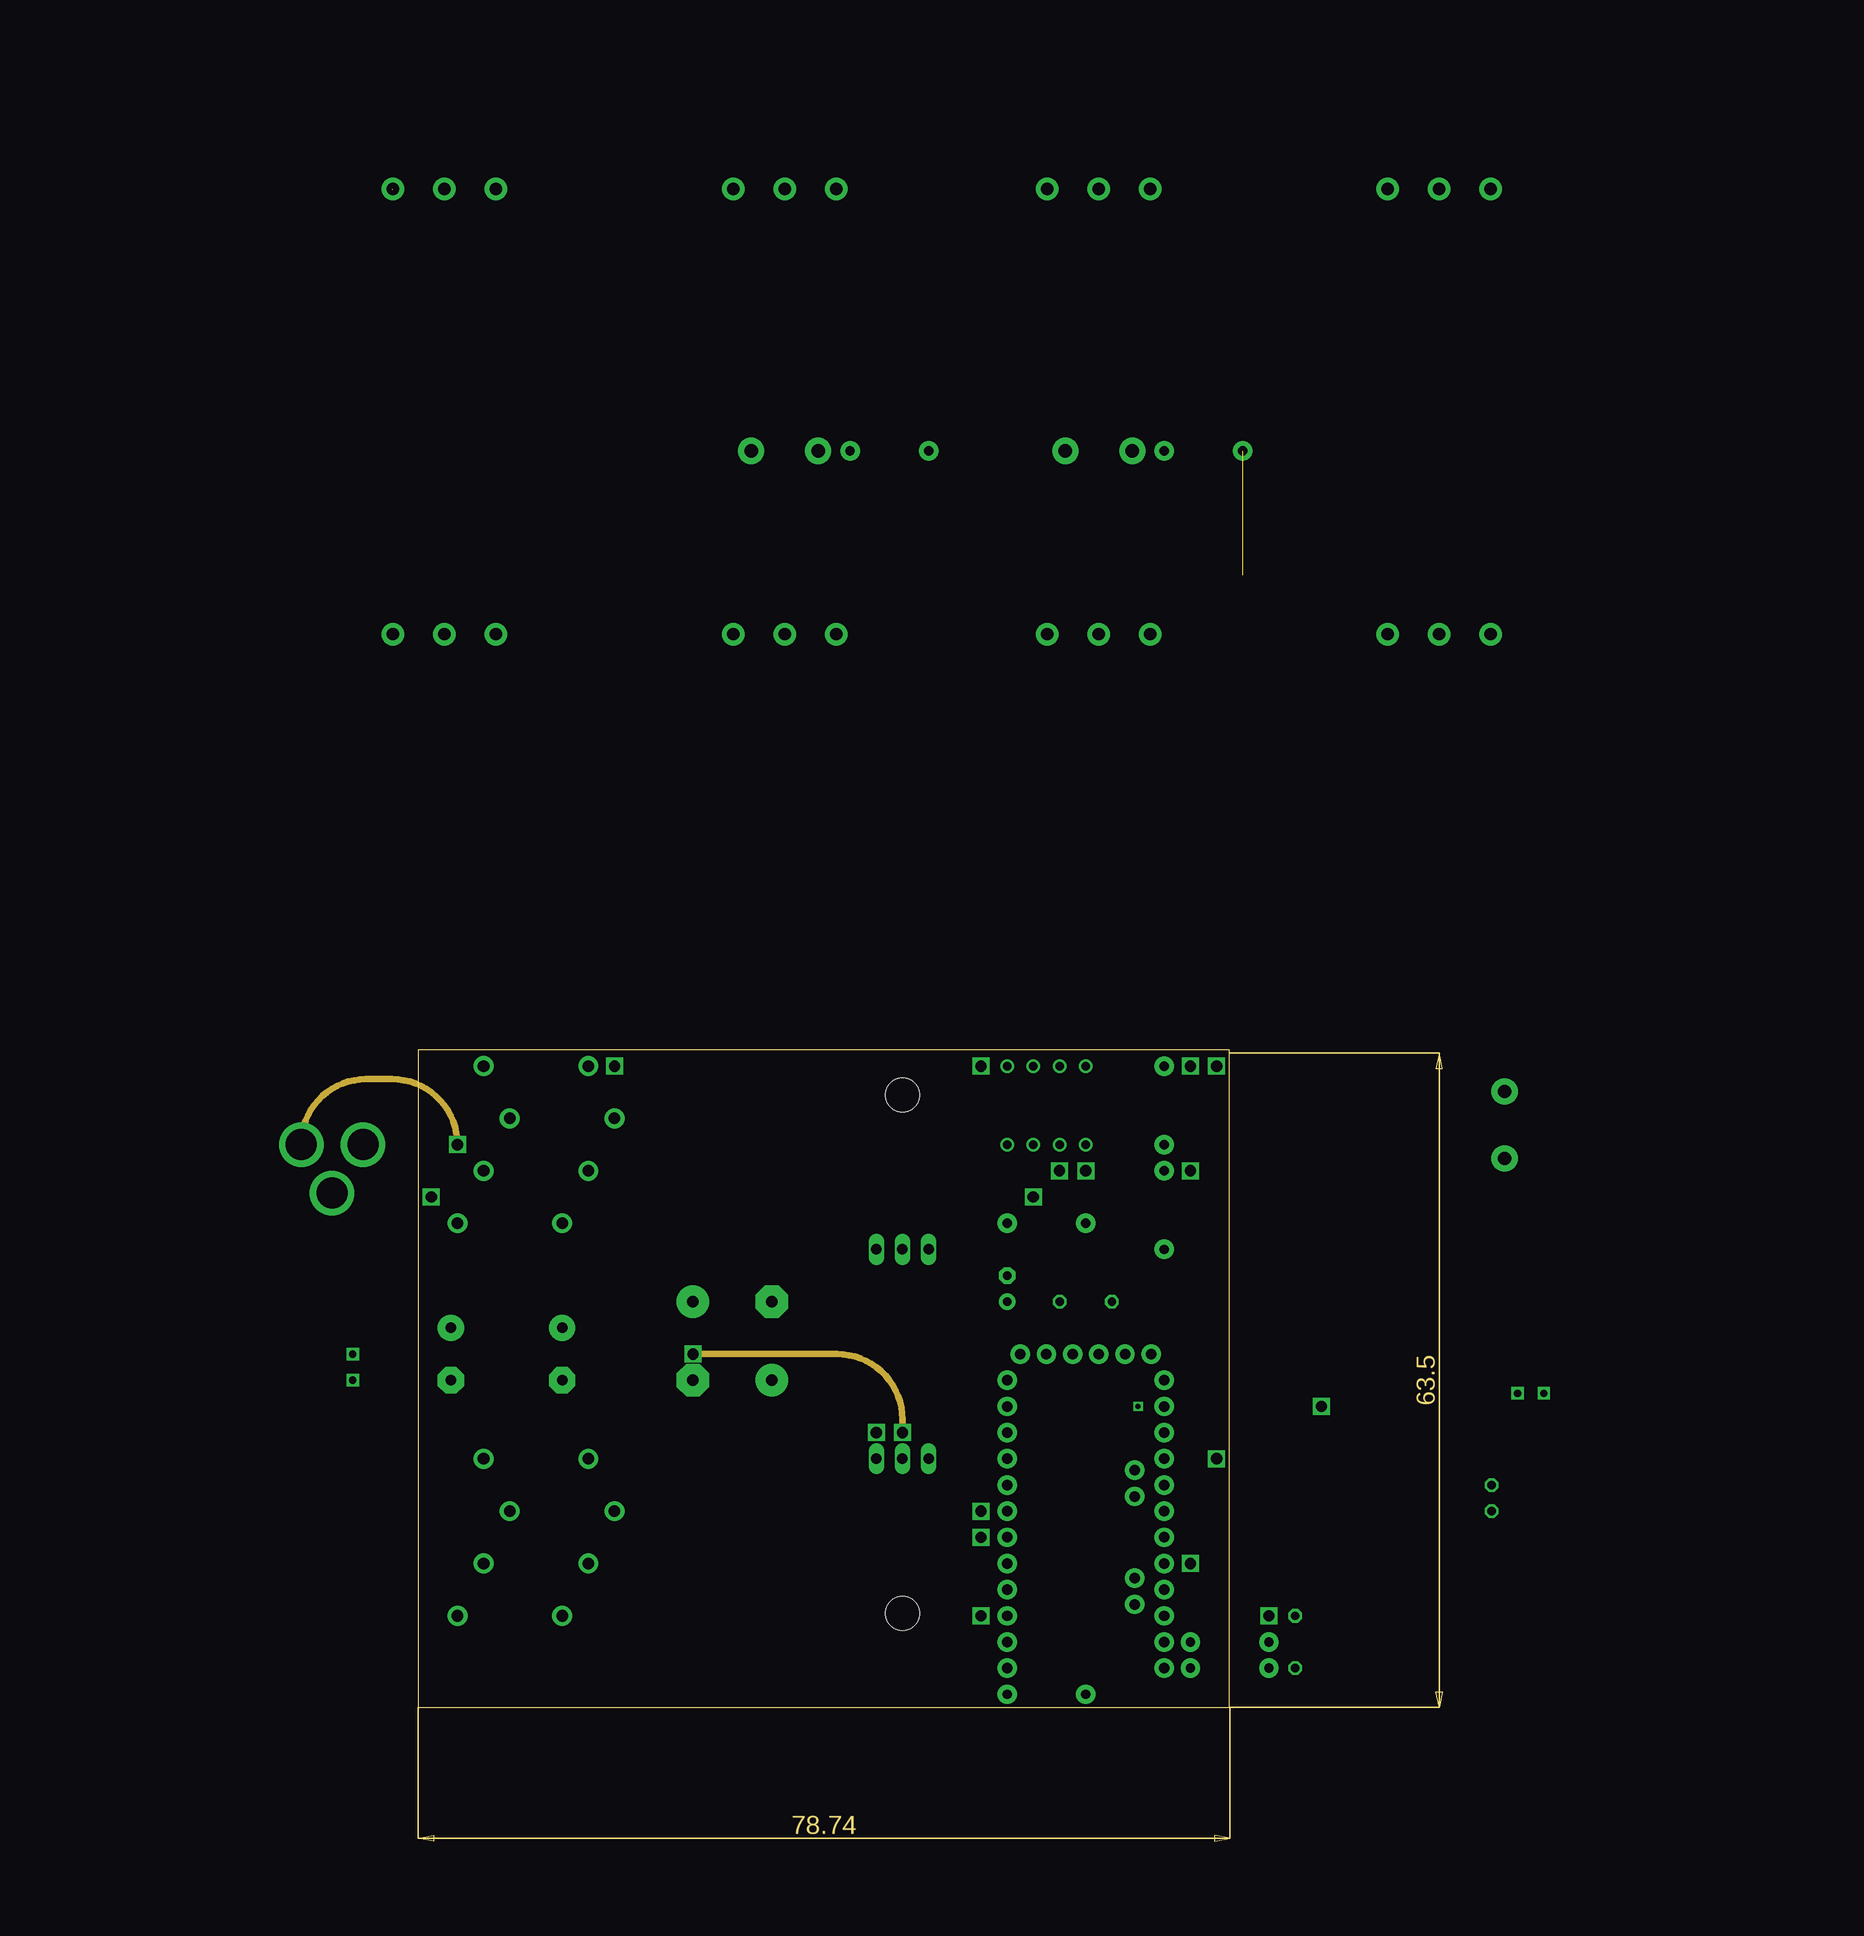
[diagram p6: board, inner layer OnBoardWire1]
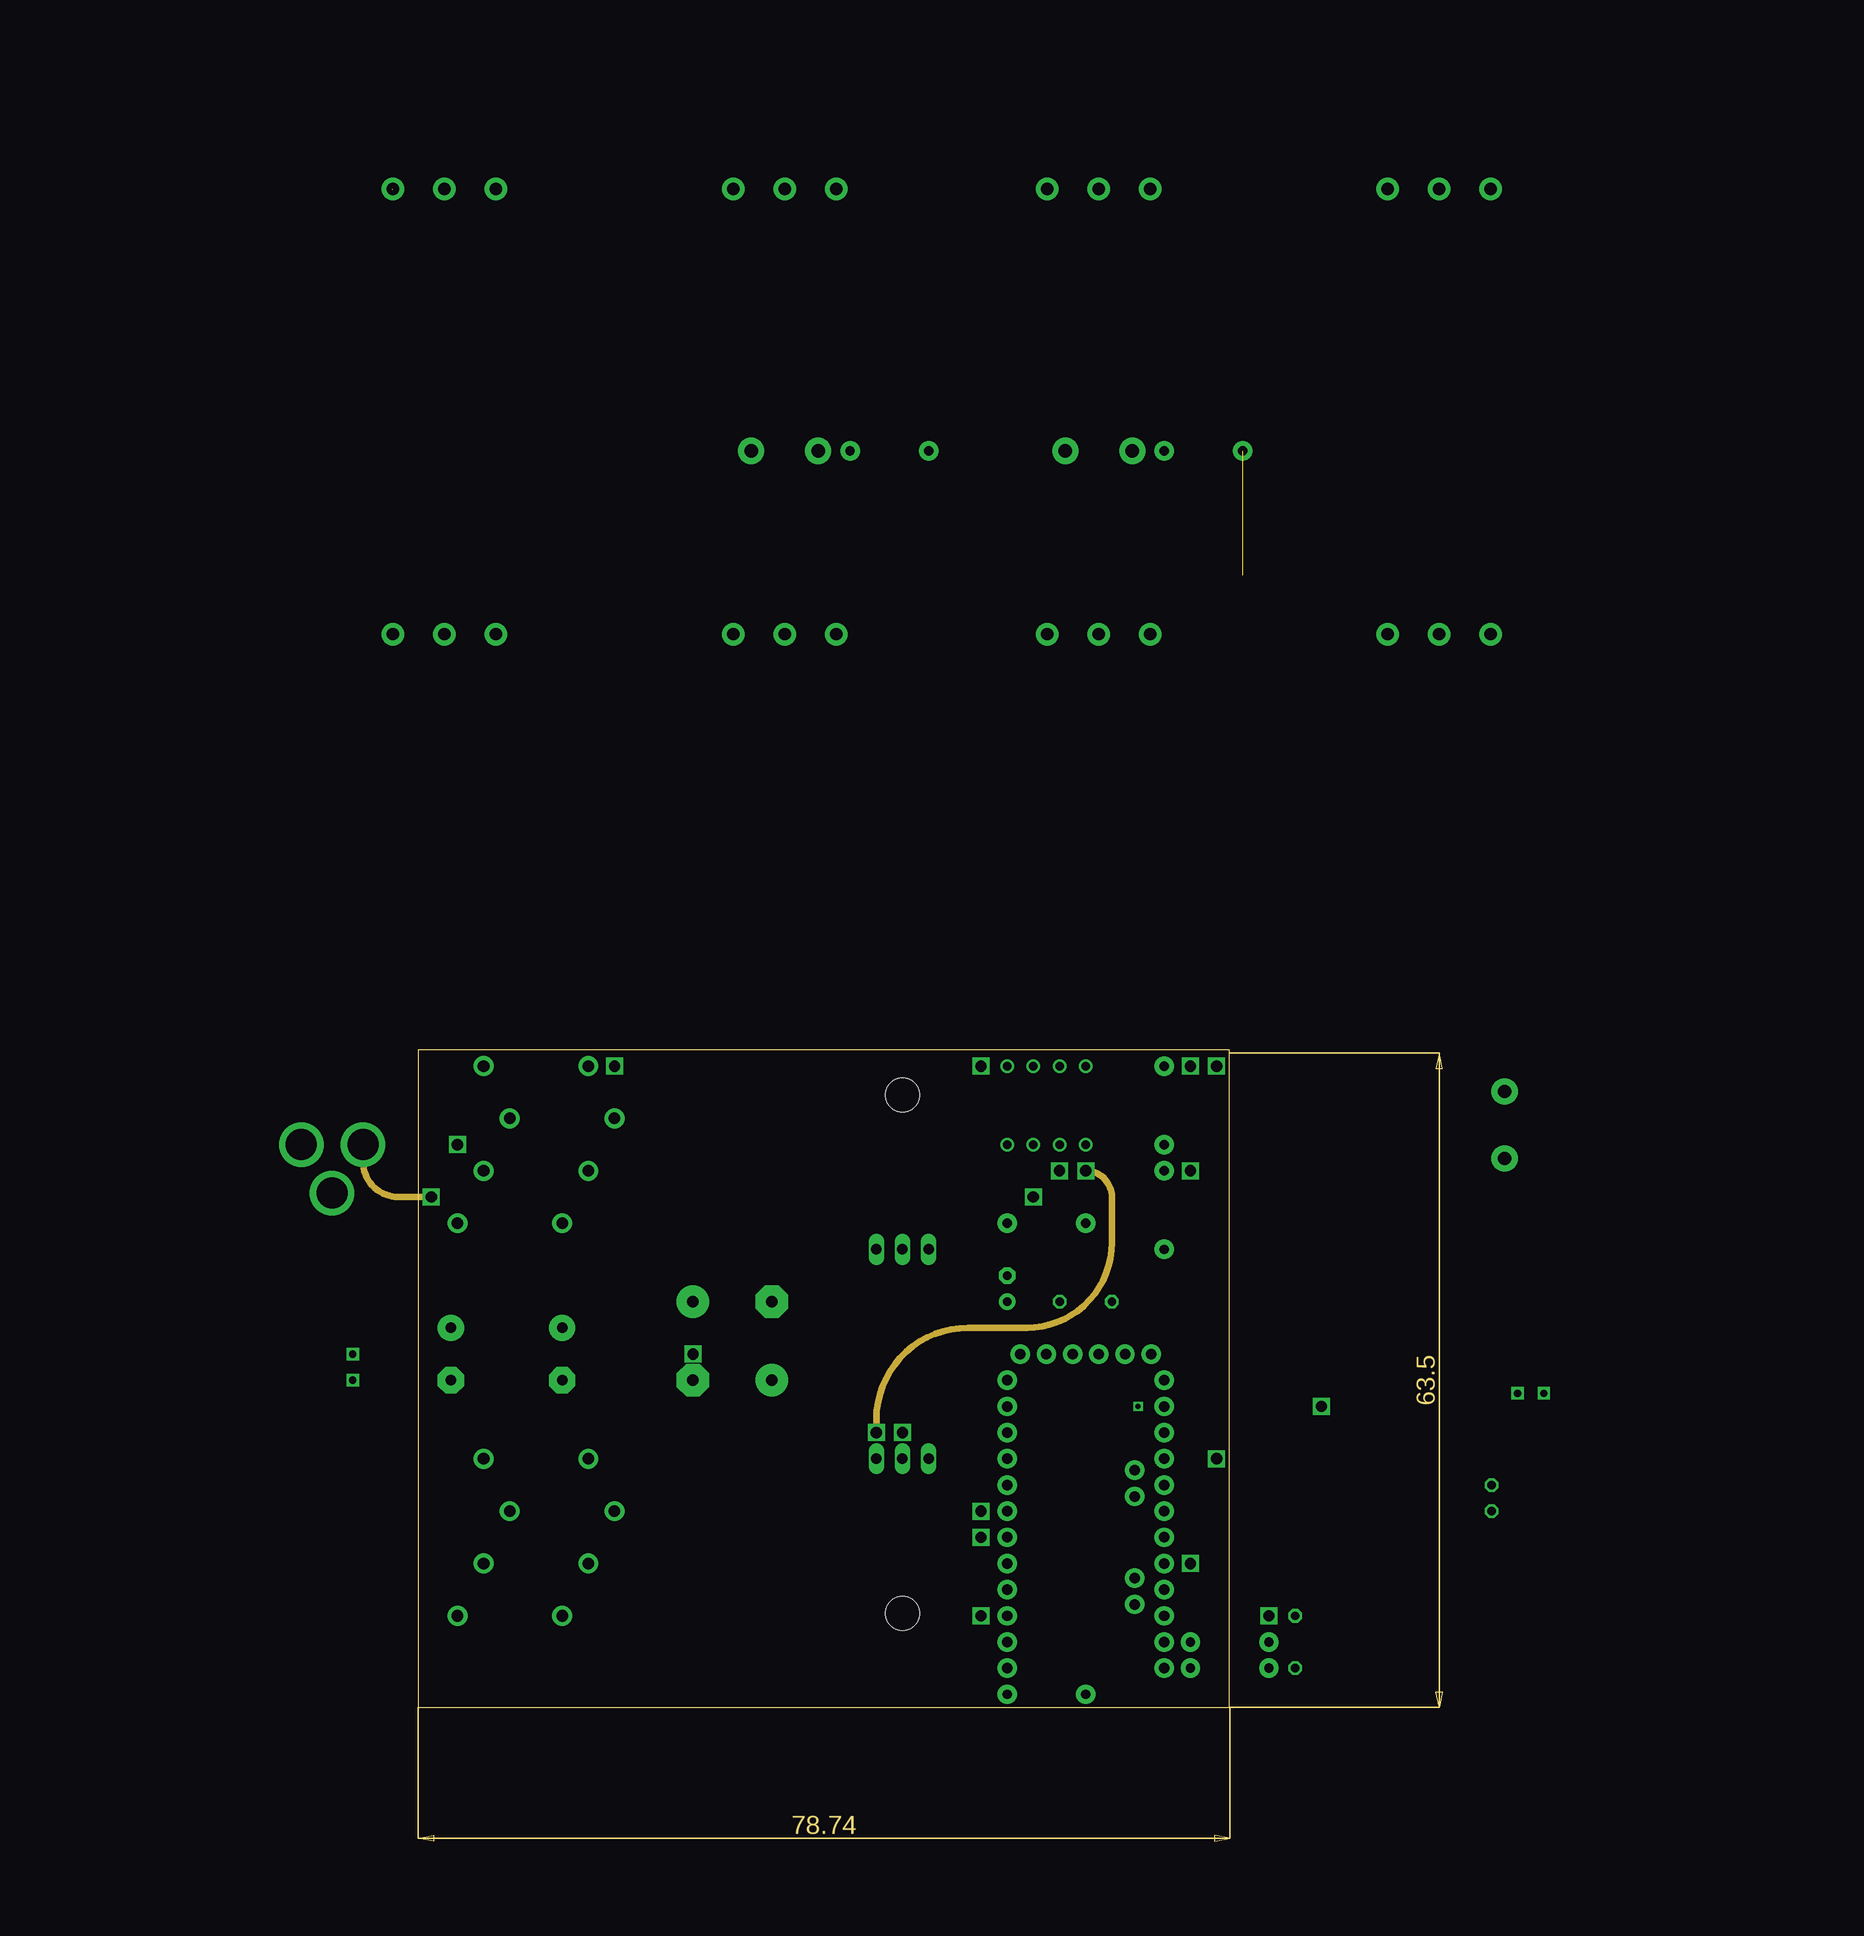
[diagram p7: board, inner layer OnBoardWire2]
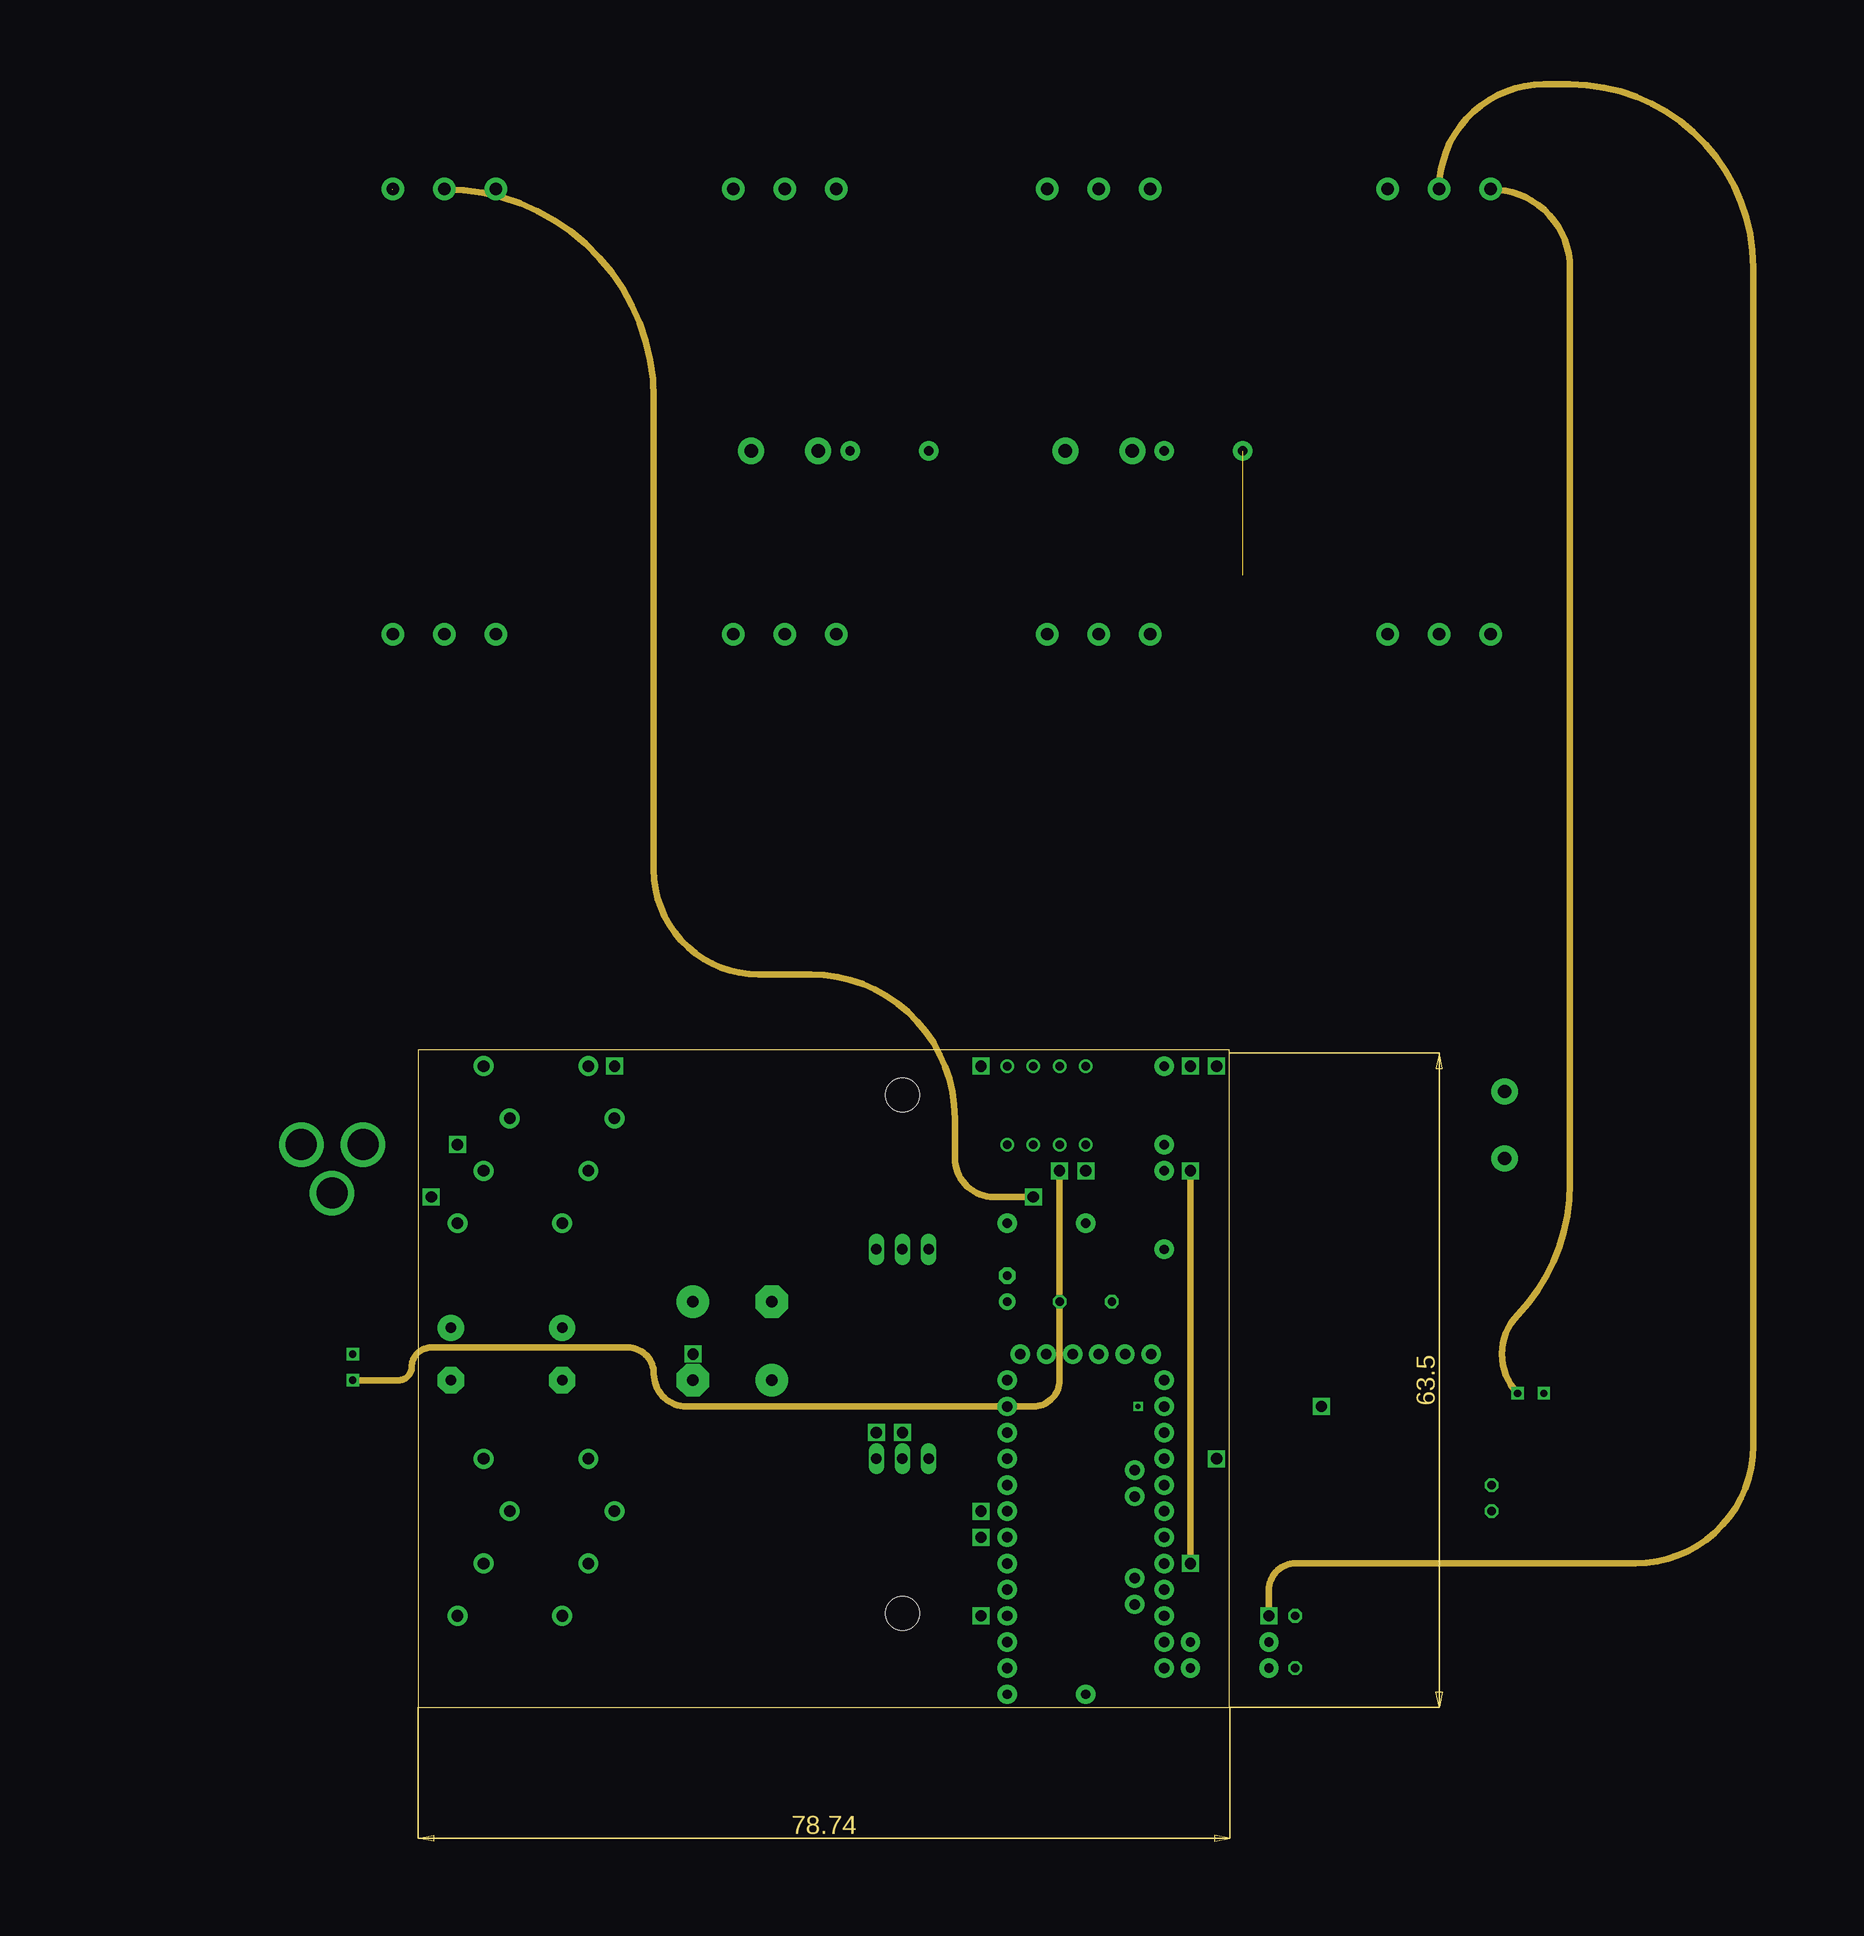
[diagram p8: board, inner layer Audio]
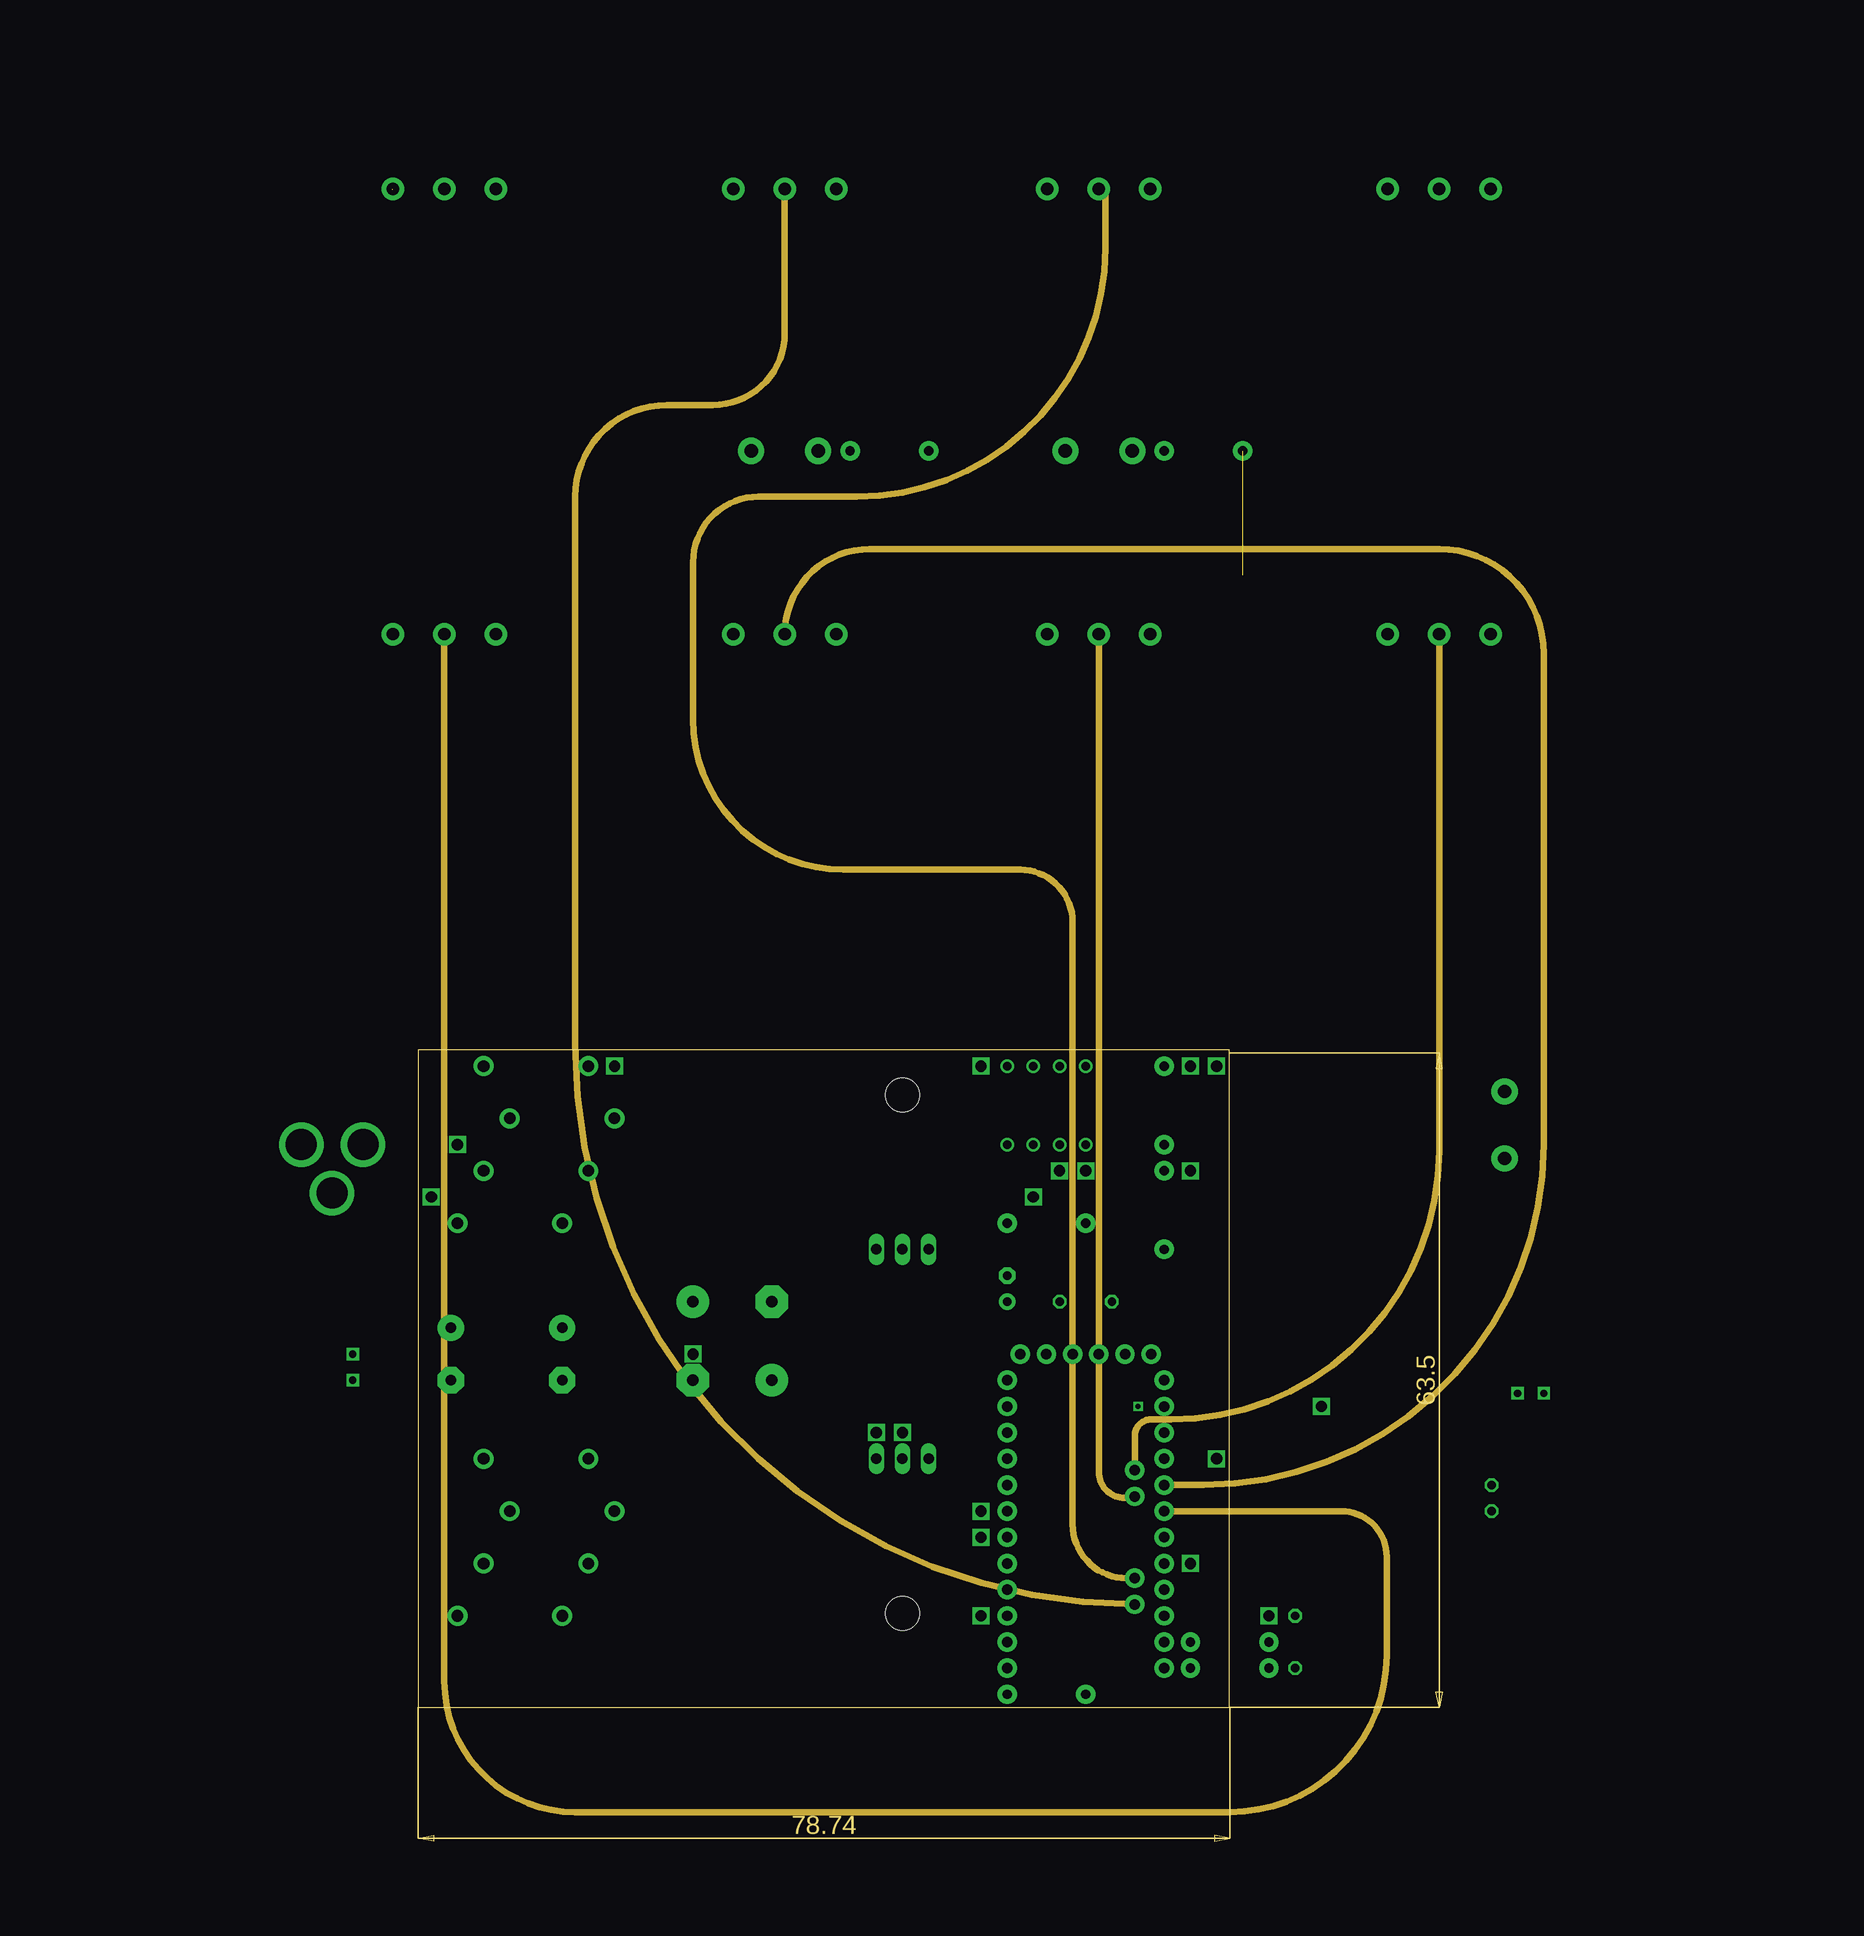
[diagram p9: board, inner layer Pots]
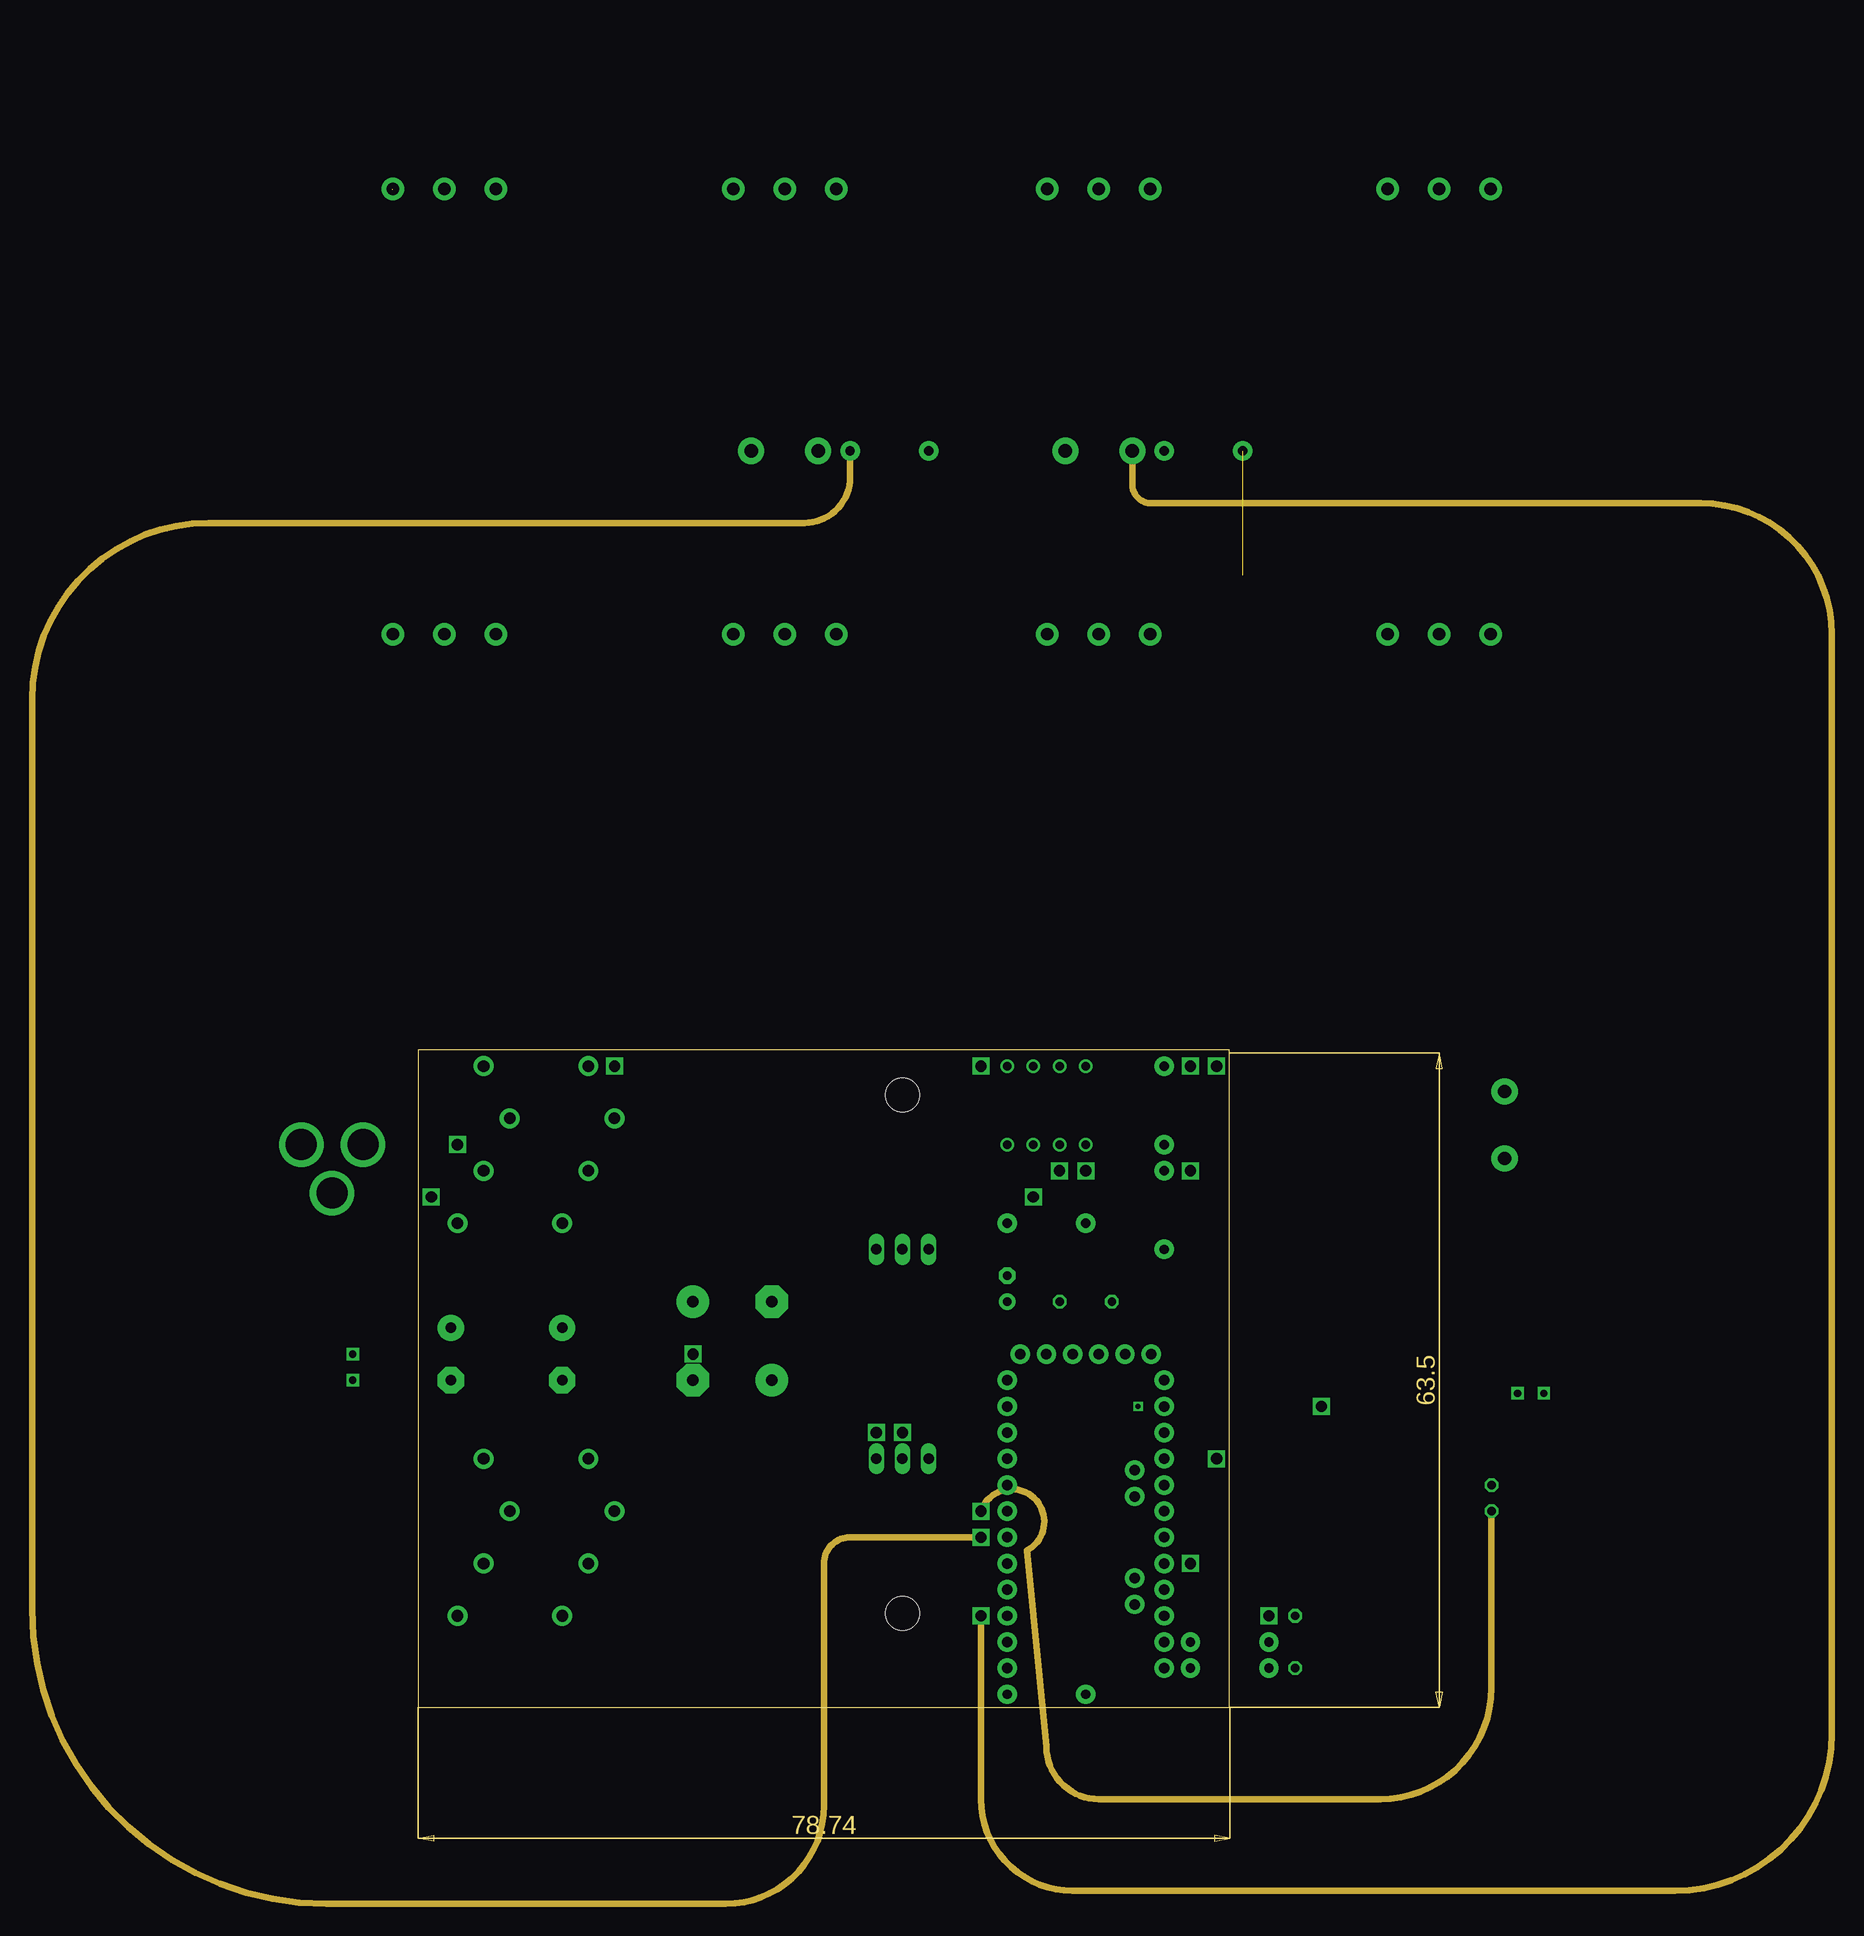
[diagram p10: board, inner layer Led&Switches]
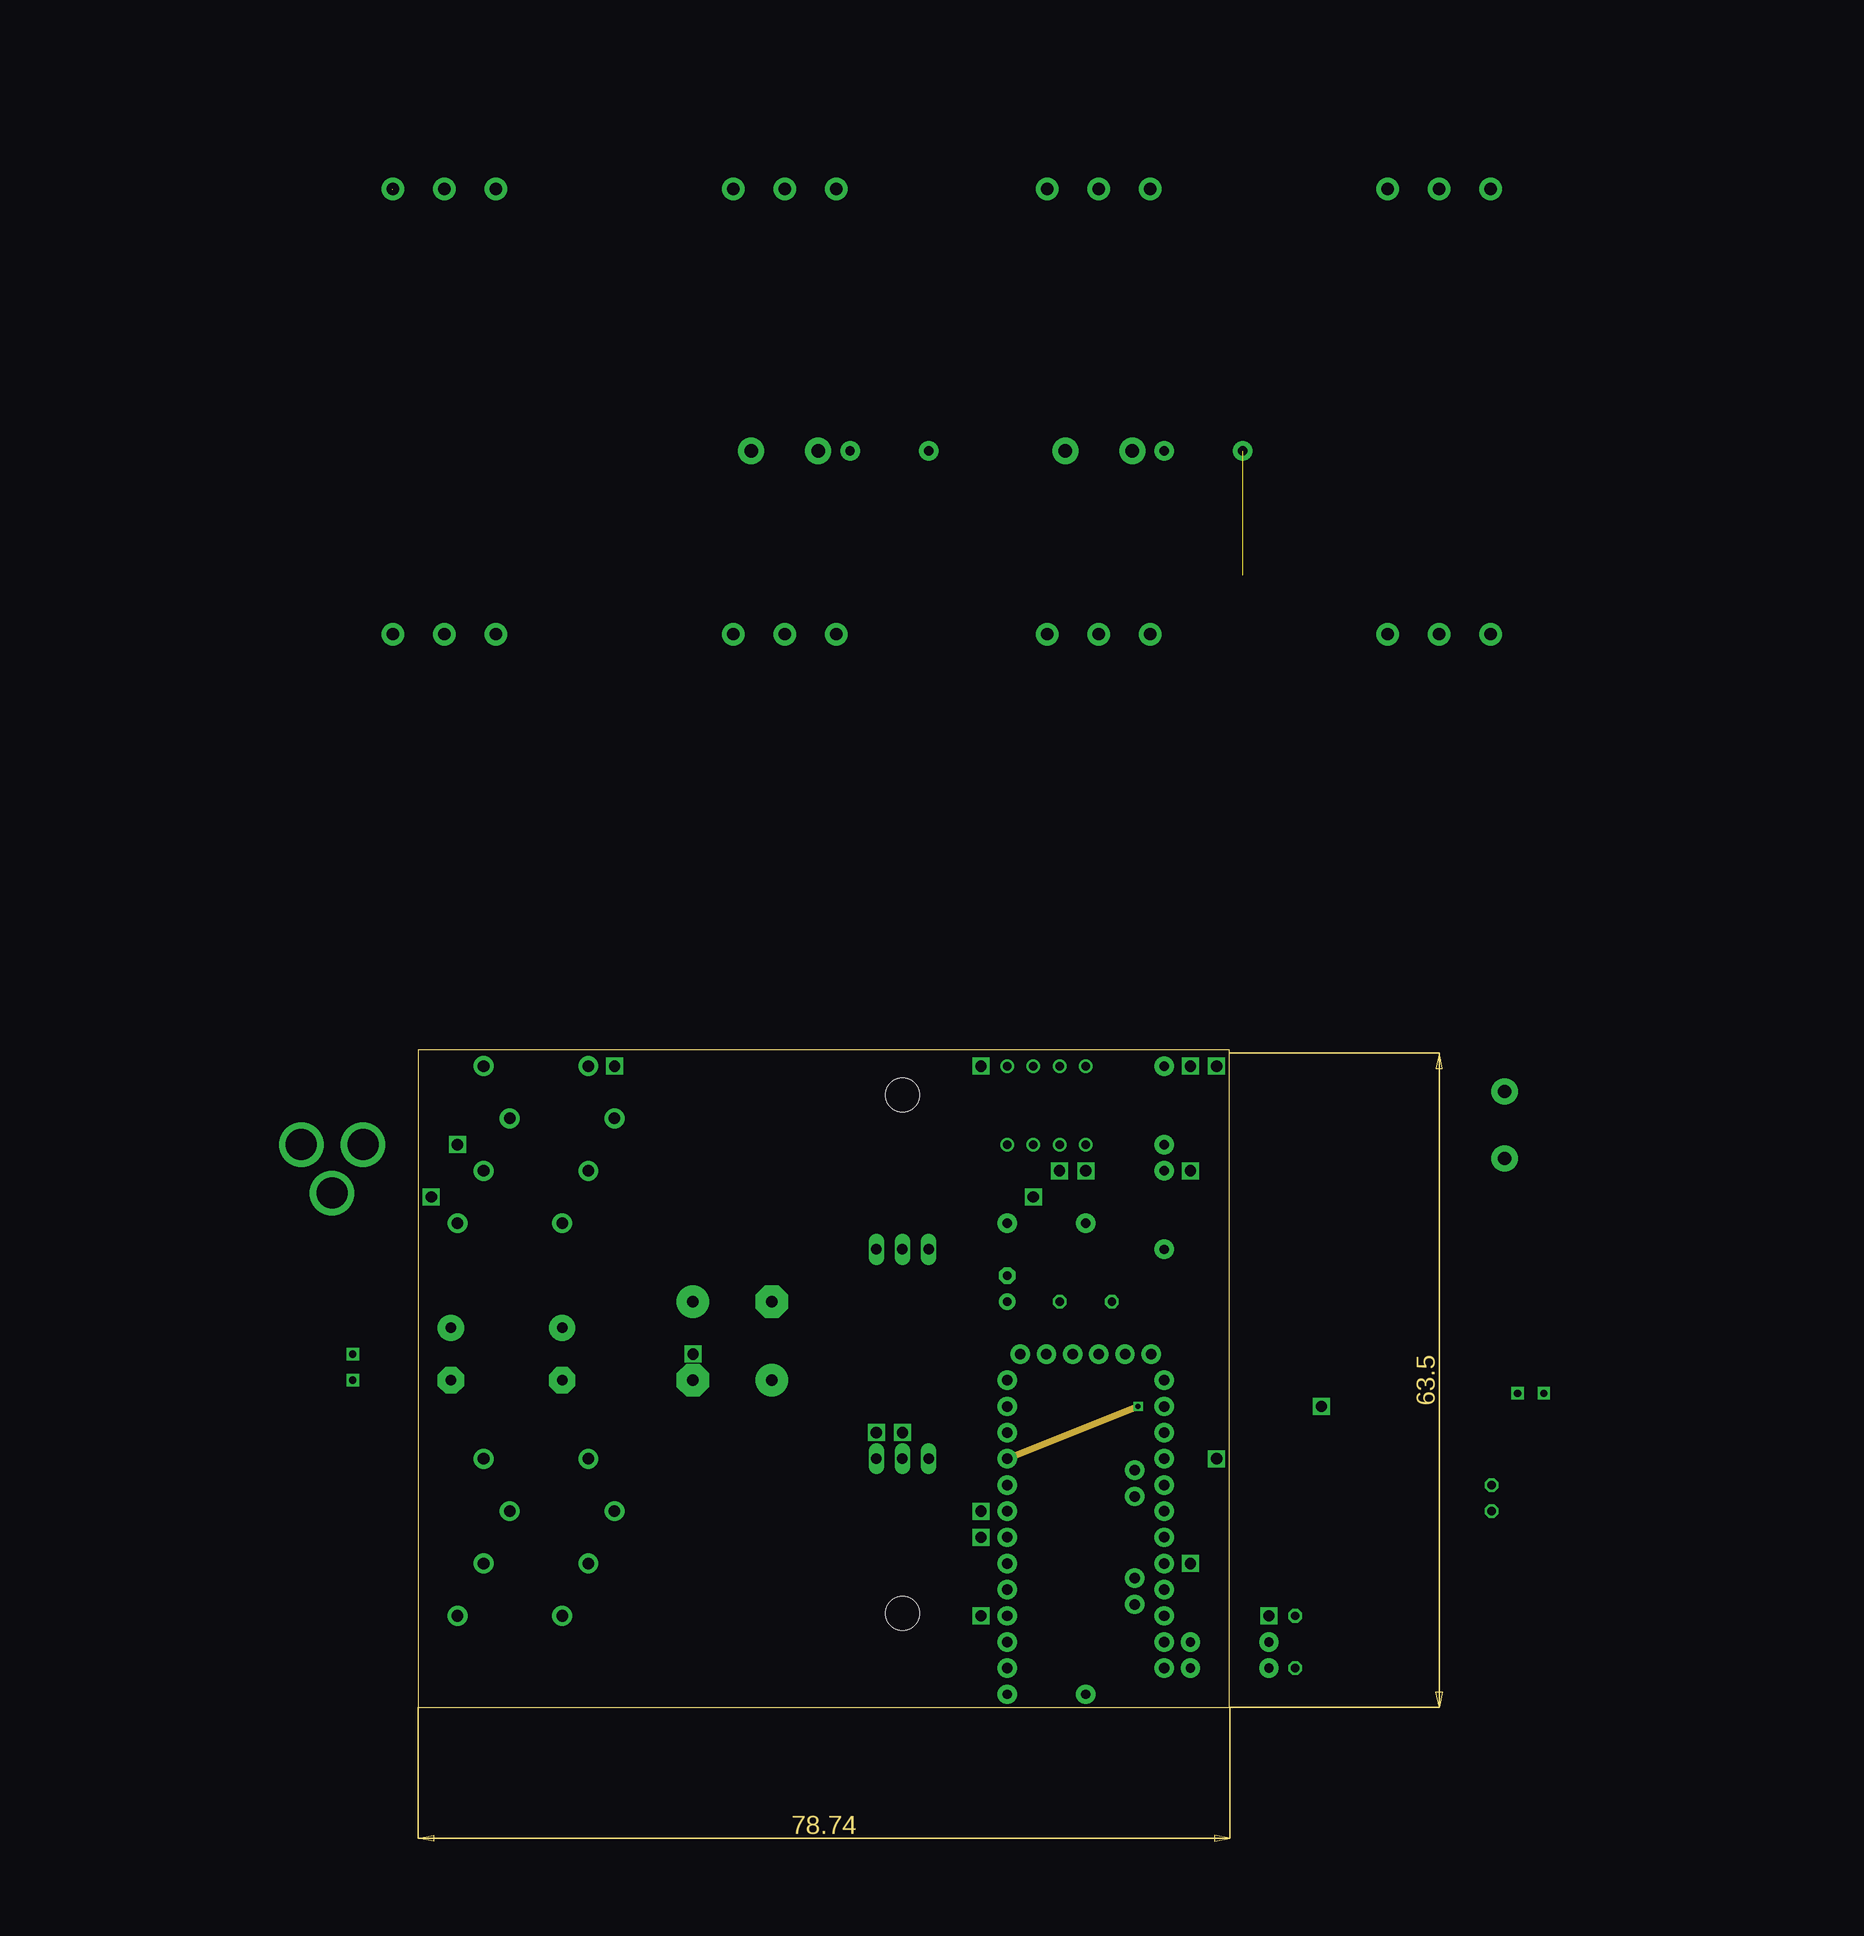
[diagram p11: board, inner layer DummyGND]
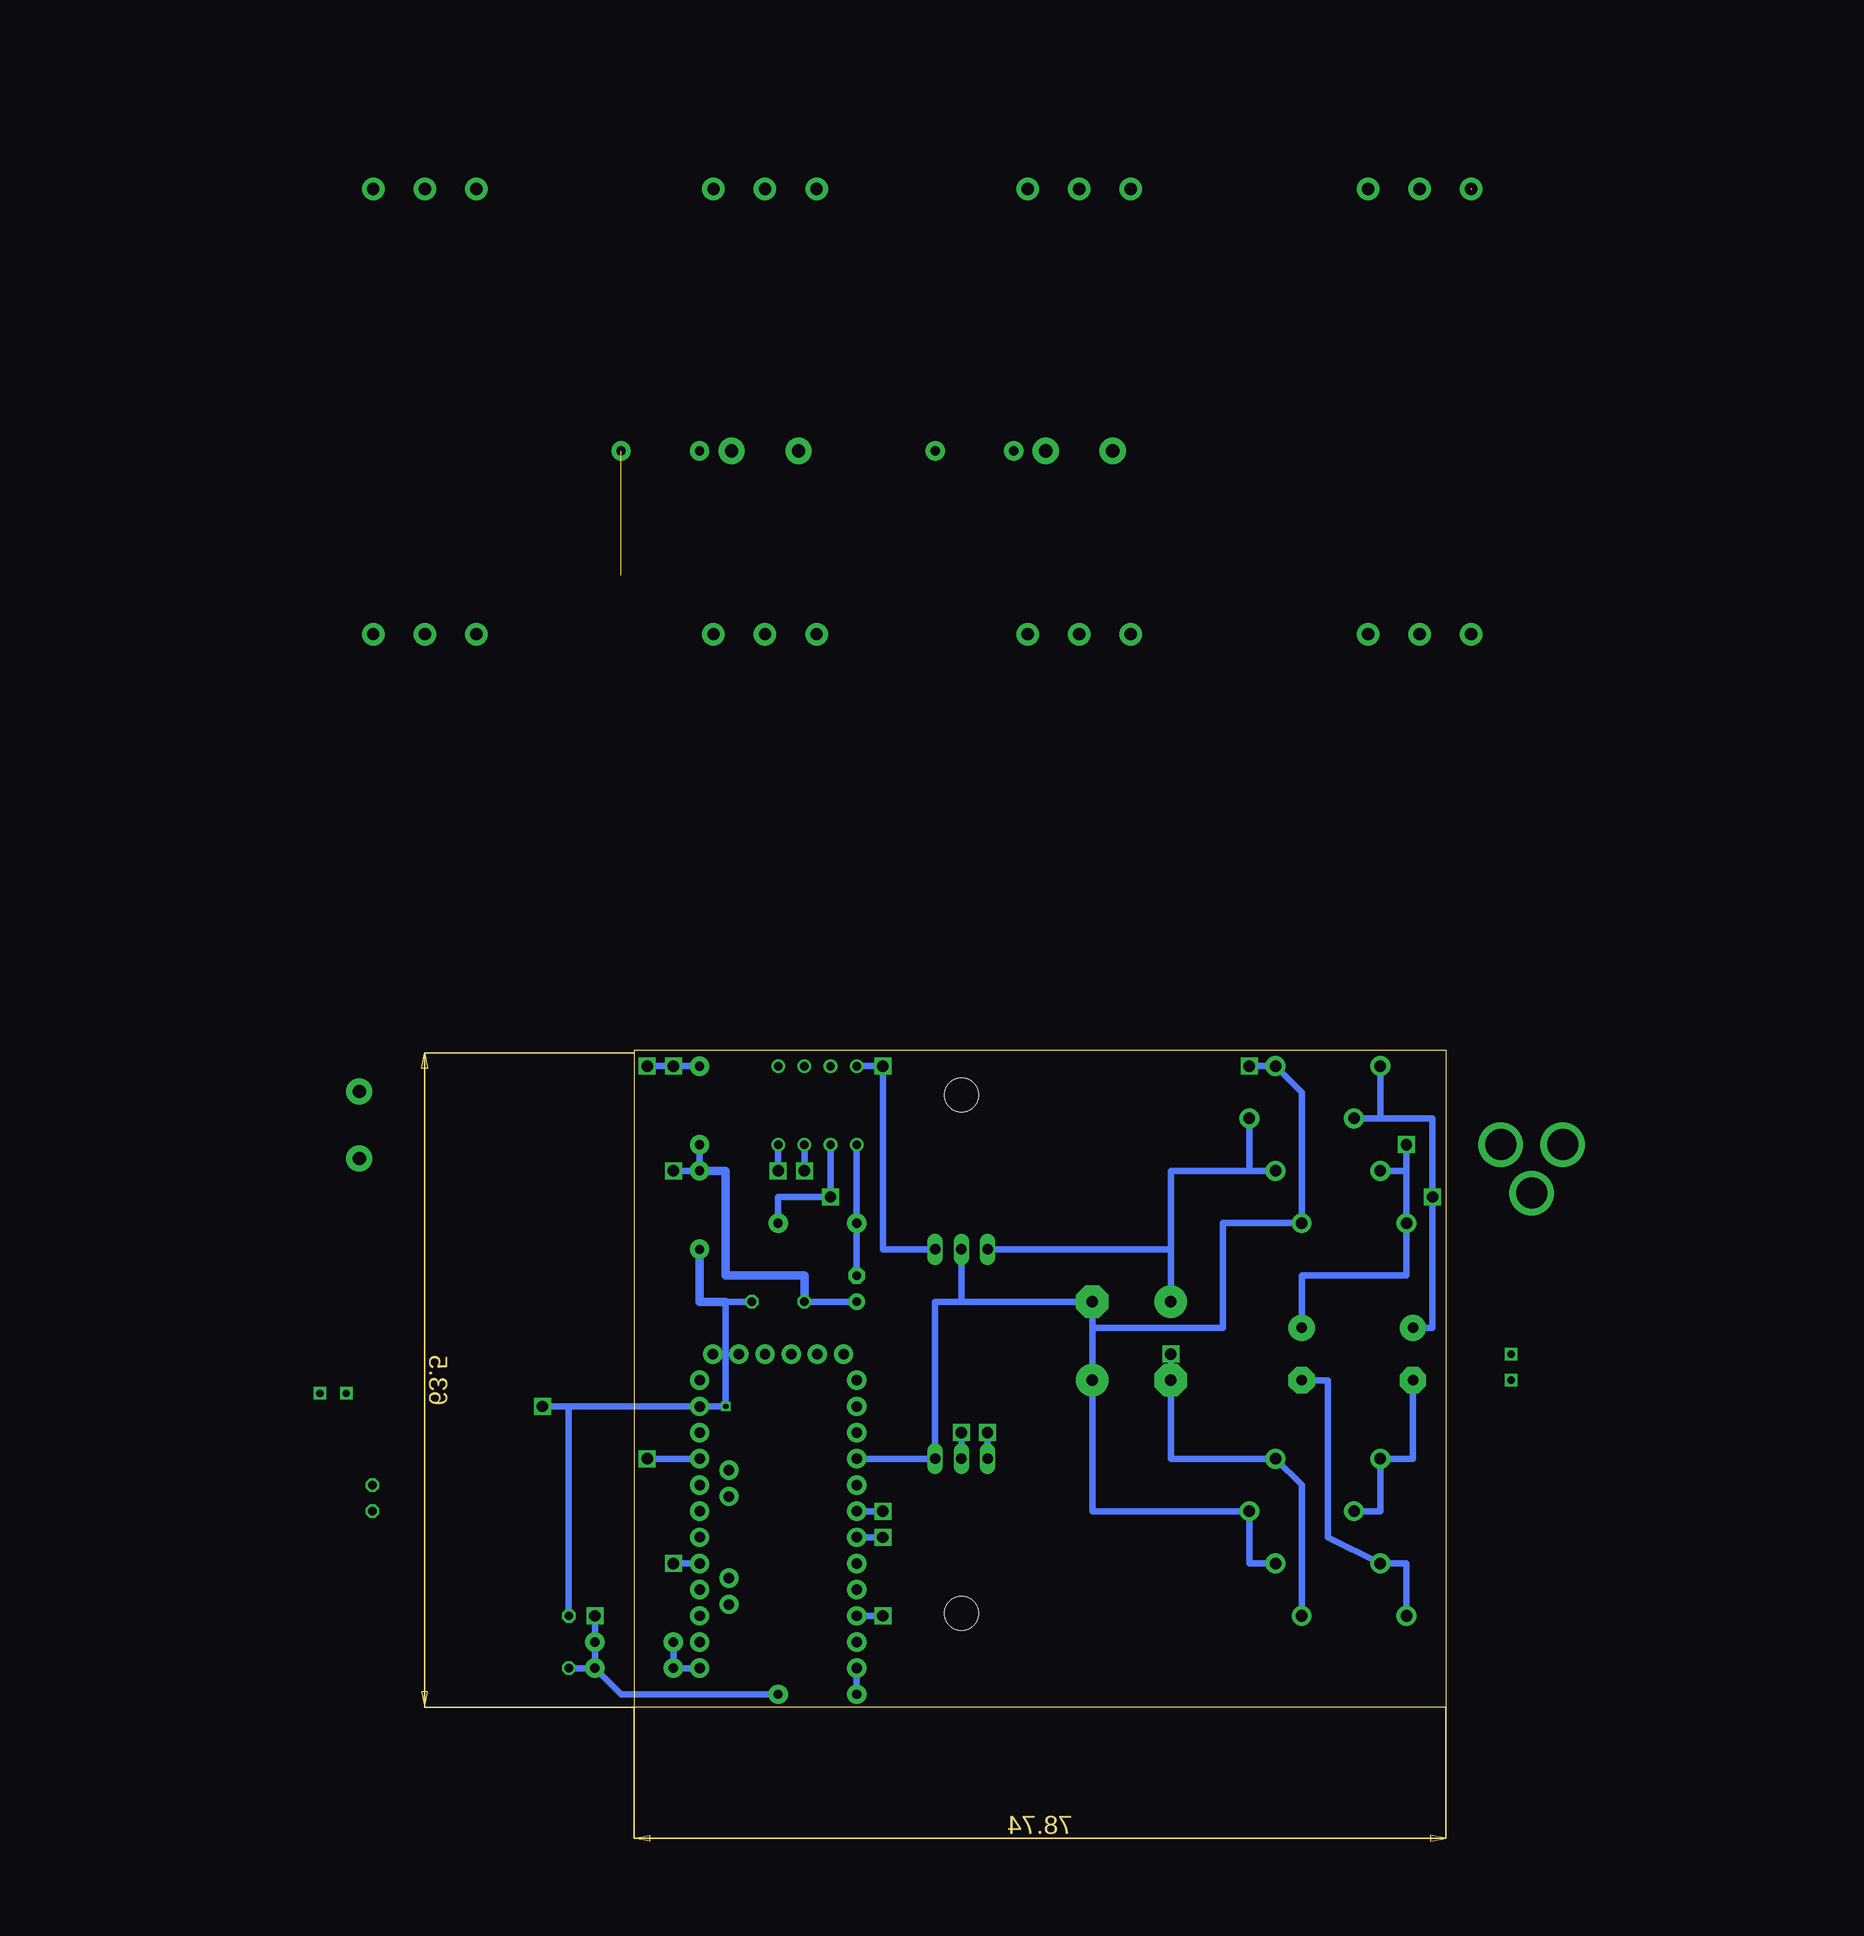
[diagram p12: board, bottom side, seen from below]

Size 99.36 x 76.81 mm. Coordinates in mm from the lower left corner, seen from the top.
Outline: 0,13 78.72,13 78.72,76.81 0,76.81 0,13
Copper layers (1+2+3+4+5+6+7+8+9+10+11+12+13+14+15+16): Top 0.035mm / dielectric 1.5mm / Ground 0.035mm / dielectric 0.15mm / 5V 0.035mm / dielectric 0.2mm / Component2Component 0.035mm / dielectric 0.15mm / +9V 0.035mm / dielectric 0.2mm / OnBoardWire1 0.035mm / dielectric 0.15mm / OnBoardWire2 0.035mm / dielectric 0.2mm / Audio 0.035mm / dielectric 0.15mm / Pots 0.035mm / dielectric 0.2mm / Led&Switches 0.035mm / dielectric 0.15mm / Route11 0.035mm / dielectric 0.2mm / Route12 0.035mm / dielectric 0.15mm / Route13 0.035mm / dielectric 0.2mm / Route14 0.035mm / dielectric 0.15mm / DummyGND 0.035mm / dielectric 0.2mm / Bottom 0.035mm
Design rules "default *": minimum track width 10mil, minimum drill 24mil, track to track 8mil, track to pad 8mil, pad to pad 8mil, via to via 8mil, smd to smd 8mil, copper to edge 40mil, drill to drill 8mil, minimum pad ring 10mil, minimum via ring 8mil, stop-mask expansion 4mil, vias tented up to drill 0mil, thermal gap 10mil

### Footprints (pad centres in the part's own frame; a part is rotated, then mirrored left to right if it is on the bottom)
ARDUINO_PRO_MINI = drill 1.016 pad 1.88: 1 -7.62,12.7; 2 -7.62,10.16; 3 -7.62,7.62; 4 -7.62,5.08; 5 -7.62,2.54; 6 -7.62,0; 7 -7.62,-2.54; 8 -7.62,-5.08; 9 -7.62,-7.62; 10 -7.62,-10.16; 11 -7.62,-12.7; 12 -7.62,-15.24; 13 7.62,-15.24; 14 7.62,-12.7; 15 7.62,-10.16; 16 7.62,-7.62; 17 7.62,-5.08; 18 7.62,-2.54; 19 7.62,0; 20 7.62,2.54; 21 7.62,5.08; 22 7.62,7.62; 23 7.62,10.16; 24 7.62,12.7; A4 4.763,1.429; A5 4.763,3.969; A6 4.763,-9.049; A7 4.763,-6.509; BLK -6.35,15.24; GND -3.81,15.24; GRN 6.35,15.24; RXI 1.27,15.24; TXO 3.81,15.24; VCC -1.27,15.24
C050-025X075 = drill 0.813 octagon: 1 -2.54,0; 2 2.54,0
E30-16 = drill 1.118 pad 3.15: + -19.05,6.35 | drill 1.118 pad 3.15 octagon: - -19.05,-1.27
E35-16 = drill 1.118 pad 3.15: + -16.51,3.81 | drill 1.118 pad 3.15 octagon: - -16.51,-3.81
E5-10,5 = drill 1.016 pad 2.54: + -2.54,0 | drill 1.016 pad 2.54 octagon: - 2.54,0
E2,5-6 = drill 0.813 pad 1.6: + -1.27,0 | drill 0.813 pad 1.6 octagon: - 1.27,0
DO41-10 = drill 1.118 pad 1.93: A 5.08,0; C -5.08,0
79XXL = drill 1.016 long: GND -2.54,-3.81; IN 0,-3.81; OUT 2.54,-3.81 | hole 3.302: 0,11.176
78XXL = drill 1.016 long: GND 0,-3.81; IN -2.54,-3.81; OUT 2.54,-3.81 | hole 3.302: 0,11.176
DIL08 = drill 0.813 pad 1.27: 1 -3.81,-3.81; 2 -1.27,-3.81; 3 1.27,-3.81; 4 3.81,-3.81; 5 3.81,3.81; 6 1.27,3.81; 7 -1.27,3.81; 8 -3.81,3.81
TWO_PADS = drill 0.7 square: SLEEVE -1.27,0; TIP 1.27,0
POWER_JACK_PTH = drill 2.997 pad 4.318: GND 0,7.7; GNDBREAK 4.7,10.7; PWR 0,13.7
LED3MM = drill 0.813 octagon: A -1.27,0; K 1.27,0
3RP/1610N = drill 1.2 pad 2.184: 1 -5,0; 2 0,0; 3 5,0
AXIAL-0.3 = drill 0.9 pad 1.88: P$1 -3.81,0; P$2 3.81,0
TACT_PANA-EVQ = drill 1.3 pad 2.54: P$1 -3.25,0; P$2 3.25,0

### Placement (x,y rotation side)
B1  64.77,32.05 0 top
C1  85.09,19.35 90 top
C2  33.02,71.42 90 top
C3  30.48,28.24 270 top
C4  13.97,47.29 270 top
C5  3.17,47.29 270 top
C6  64.77,52.37 0 top
C7  57.15,53.64 90 top
D1  11.43,75.23 0 top
D2  13.97,70.15 180 top
D3  11.43,65.07 180 top
D4  8.89,59.99 0 top
D5  11.43,37.13 0 top
D6  13.97,32.05 180 top
D7  11.43,26.97 180 top
D8  8.89,21.89 0 top
IC1  46.99,33.32 180 top
IC2  46.99,61.26 0 top
IC3  60.96,71.42 0 top
JIN  -6.35,46.02 270 top  (outside the outline)
JOUT  107.95,43.48 180 top  (outside the outline)
JPWR  -19.05,67.61 270 top  (outside the outline)
LED1  104.14,33.32 90 top  (outside the outline)
P1  2.54,117.14 0 top  (outside the outline)
P2  35.56,117.14 0 top  (outside the outline)
P3  66.04,117.14 0 top  (outside the outline)
P4  99.06,117.14 0 top  (outside the outline)
P5  35.56,160.32 0 top  (outside the outline)
P6  66.04,160.32 0 top  (outside the outline)
PVIN  2.54,160.32 0 top  (outside the outline)
PVOUT  99.06,160.32 0 top  (outside the outline)
R1  60.96,14.27 180 top
R2  78.74,19.35 180 top
R3  78.74,16.81 180 top
R4  60.96,59.99 180 top
R5  72.39,71.42 90 top
R6  72.39,61.26 90 top
R7  45.72,134.92 0 top  (outside the outline)
R8  76.2,134.92 0 top  (outside the outline)
SPWR  105.41,69.52 270 top  (outside the outline)
SW1  35.56,134.92 0 top  (outside the outline)
SW2  66.04,134.92 0 top  (outside the outline)

### Tracks (layer width: path | path; a pad name or v marks a point on that pad's centre or on a via)
+5V  (via drill 1.1)  (1 unrouted)
  5V 0.61: P1.3 7.54,104.52 arc90 15.24,96.82 35.56,96.82 arc90 40.64,101.9 40.64,117.06 arc90 P2.3 42.55,117.14 arc90 49.53,124.12 R7.P$2 49.53,151.35 arc90 P5.3 arc-90 55.8,175.56 63.5,175.56 arc-90 71.04,168.02 P6.3 arc-90 80.01,151.35 R8.P$2 | 71.12,117.14 74.3,117.14 arc90 80.01,122.86 | 71.12,117.14 arc90 87.63,100.63 101.6,100.63 arc90 104.14,103.17 | 71.12,117.14 P3.3 | v77.47,37.13 77.47,67.61 arc53 74.93,72.69 arc-106 v74.93,75.23 | v77.47,75.23 88.27,75.23 arc90 104.14,91.11 104.14,103.17 | 104.14,103.17 104.14,117.06 arc90 P4.3
  Bottom 0.61: R5.P$2 v74.93,75.23 v77.47,75.23 | B1.21 v77.47,37.13
+9V  (via drill 1.1)
  +9V 0.61: SPWR.P$1 arc90 97.86,80.31 57.15,80.31 arc90 54.61,77.77 v54.61,75.23
  Bottom 0.61: IC3.8 v54.61,75.23 54.61,57.45 IC2.OUT
-9V  (via drill 1.1)
  OnBoardWire2 0.61: v44.45,39.67 44.45,40.94 arc-90 53.34,49.83 59.05,49.83 arc90 67.31,58.09 67.31,62.53 arc90 v64.77,65.07
  Bottom 0.61: IC1.OUT v44.45,39.67 | IC3.4 v64.77,65.07
GND  (via drill 0.5, 1.1)  (1 unrouted)
  Ground 0.61: -2.54,160.32 -2.54,117.14 P1.1 arc90 -2.54,117.06 -2.62,117.06 arc90 -25.4,94.28 -25.4,66.34 arc90 -15.24,56.18 -10.79,56.18 arc-90 -6.35,51.73 JIN.SLEEVE | PVIN.1 -2.46,162.94 arc-90 5.08,170.48 20.4,170.48 arc-90 P5.1 30.56,162.94 arc-90 38.1,170.48 50.88,170.48 arc-90 P6.1 61.04,160.4 arc-90 68.58,167.94 86.36,167.94 arc-90 93.98,160.32 PVOUT.1 arc-90 73.74,140 66.04,140 | SW2.P$1 62.79,136.75 arc-90 66.04,140 | 66.04,140 35.56,140 arc90 32.31,136.75 SW1.P$1 arc90 30.48,133.09 30.48,117.14 P2.1 30.56,101.82 arc90 33.02,99.36 43.26,99.36 arc90 P3.1 61.04,104.36 arc90 66.04,99.36 76.28,99.36 arc90 P4.1 arc-90 93.98,117.22 93.98,124.76 arc-90 96.52,127.3 101.6,127.3 arc-90 116.84,112.06 116.84,51.1 arc-90 JOUT.SLEEVE 109.22,37.13 arc-90 106.68,34.59 LED1.K arc90 96.52,42.21 v87.63,42.21
  DummyGND 0.61: B1.4 v69.85,42.21
  Bottom 0.61: D7.C 19.05,26.97 D6.C 34.29,32.05 C3.+ 34.29,49.83 | 34.29,49.83 C2.- 46.99,52.37 | v19.05,75.23 D1.A 13.97,72.69 D4.A 21.59,59.99 21.59,49.83 34.29,49.83 | C6.2 69.85,52.37 v69.85,42.21 B1.23 85.09,42.21 | 46.99,52.37 IC2.GND | 85.09,42.21 C1.2 | B1.4 IC1.GND 49.53,52.37 46.99,52.37 | 85.09,42.21 v87.63,42.21
  Bottom 0.813: 69.85,52.37 72.39,52.37 R6.P$1
IN  (via drill 1.1)
  Audio 0.61: v74.93,26.97 v74.93,65.07
  Bottom 0.61: R5.P$1 R6.P$2 v74.93,65.07 | C6.1 C7.+ | v74.93,26.97 B1.17
  Bottom 0.813: R6.P$2 69.85,65.07 69.85,54.91 62.23,54.91 C6.1
JL1  (via drill 1.1)
  Led&Switches 0.61: LED1.A 104.14,14.9 arc-90 93.34,4.11 66.04,4.11 arc-90 60.96,9.19 59.05,28.24 arc224 v54.61,32.05
  Bottom 0.61: v54.61,32.05 B1.6
JP1
  Pots 0.61: P1.2 2.54,15.54 arc90 15.24,2.84 78.74,2.84 arc90 93.98,18.08 93.98,27.61 arc90 89.53,32.05 B1.19
JP2
  Pots 0.61: B1.20 76.2,34.59 arc90 109.22,67.61 109.22,115.23 arc90 99.06,125.39 43.81,125.39 arc90 P2.2
JP3
  Pots 0.61: P3.2 66.04,35.86 arc90 68.58,33.32 69.37,33.32 arc90 B1.A4
JP4
  Pots 0.61: B1.A5 69.53,39.35 arc-90 71.12,40.94 73.03,40.94 arc90 99.06,66.97 P4.2
JP5
  Pots 0.61: P5.2 35.56,146.35 arc-90 28.57,139.37 24.13,139.37 arc90 15.24,130.47 15.24,77.29 arc90 B1.A6
JP6
  Pots 0.61: B1.A7 68.74,25.54 arc-90 63.5,30.78 63.5,89.2 arc90 58.42,94.28 41.27,94.28 arc-90 26.67,108.89 26.67,124.12 arc-90 33.02,130.47 42.55,130.47 arc90 66.67,154.6 66.67,159.69 arc90 P6.2
JP8-2  (via drill 1.1)
  Audio 0.61: v82.55,21.89 82.55,24.43 arc-90 85.09,26.97 118.11,26.97 arc90 129.54,38.4 129.54,152.7 arc90 111.76,170.48 109.22,170.48 arc90 PVOUT.2
  Bottom 0.61: R3.P$1 C1.1 | R3.P$1 R2.P$1 v82.55,21.89 | R1.P$1 80.01,14.27 R3.P$1
JP8-3
  Audio 0.61: PVOUT.3 arc-90 111.76,152.62 111.76,63.8 arc-44 106.68,51.1 arc87 JOUT.TIP
JS1  (via drill 1.1)
  Component2Component 0.61: SW1.P$2 R7.P$1
  Led&Switches 0.61: R7.P$1 41.91,132.38 arc-90 37.47,127.94 -20.32,127.94 arc90 -37.47,110.79 -37.47,22.52 arc90 -8.89,-6.05 29.84,-6.05 arc90 39.37,3.47 39.37,26.97 arc-90 41.91,29.51 v54.61,29.51
  Bottom 0.61: B1.7 v54.61,29.51
JS2  (via drill 1.1)
  Component2Component 0.61: R8.P$1 SW2.P$2
  Led&Switches 0.61: SW2.P$2 69.29,131.67 arc90 71.12,129.84 124.46,129.84 arc-90 137.16,117.14 137.16,10.46 arc-90 121.92,-4.78 63.5,-4.78 arc-90 54.61,4.11 v54.61,21.89
  Bottom 0.61: B1.10 v54.61,21.89
MZ1
  Bottom 0.61: B1.12 R1.P$2
MZ2
  Bottom 0.61: B1.13 R3.P$2 R2.P$2
N$1  (via drill 1.1)
  OnBoardWire2 0.61: JPWR.PWR -5.35,65.97 arc90 -1.91,62.53 v1.27,62.53
  Bottom 0.61: D2.A 6.35,70.15 | 6.35,70.15 D1.C | C5.+ 1.27,49.83 v1.27,62.53 1.27,70.15 6.35,70.15
N$2
  Bottom 0.61: D6.A 6.35,32.05 D5.C 3.17,37.13 C5.-
N$3  (via drill 1.1)
  OnBoardWire1 0.61: JPWR.GND -11.35,67.69 arc-90 -5.08,73.96 -2.54,73.96 arc-90 v3.81,67.61
  Bottom 0.61: D3.A 3.81,65.07 | 3.81,65.07 D4.C 3.81,54.91 13.97,54.91 C4.+ | 3.81,65.07 v3.81,67.61
N$4
  Bottom 0.61: D8.C 3.81,26.97 D7.A 11.43,29.51 11.43,44.75 C4.-
N$5
  Bottom 0.61: D3.C 19.05,65.07 | 19.05,65.07 D2.C | 19.05,65.07 26.67,65.07 26.67,58.72 26.67,57.45 | 26.67,57.45 C2.+ | IC2.IN 26.67,57.45
N$6
  +9V 0.61: B1.24 83.89,44.75 arc90 SPWR.P$2
N$7  (via drill 1.1)
  OnBoardWire1 0.61: v46.99,39.67 46.99,40.94 arc90 40.64,47.29 v26.67,47.29
  Bottom 0.61: D8.A 13.97,34.59 D5.A 26.67,37.13 C3.- v26.67,47.29 | IC1.IN v46.99,39.67
N$8
  Bottom 0.61: C7.- R4.P$2 IC3.1
N$9  (via drill 1.1)
  Audio 0.61: PVIN.2 arc-90 22.86,140 22.86,94.28 arc90 33.02,84.12 38.1,84.12 arc-90 52.07,70.15 52.07,66.34 arc90 55.88,62.53 v59.69,62.53
  Bottom 0.61: R4.P$1 64.77,62.53 v59.69,62.53 IC3.2
N$15  (via drill 1.1)
  Audio 0.61: JIN.TIP -1.91,44.75 arc90 -0.64,46.02 arc-90 1.27,47.92 20.32,47.92 arc-90 22.86,45.38 arc90 26.04,42.21 59.69,42.21 arc90 62.23,44.75 v62.23,65.07
  Bottom 0.61: IC3.3 v62.23,65.07